# Altium project LimeMM-X8-FMC_1v0.PrjPcb (part 1 of 7)
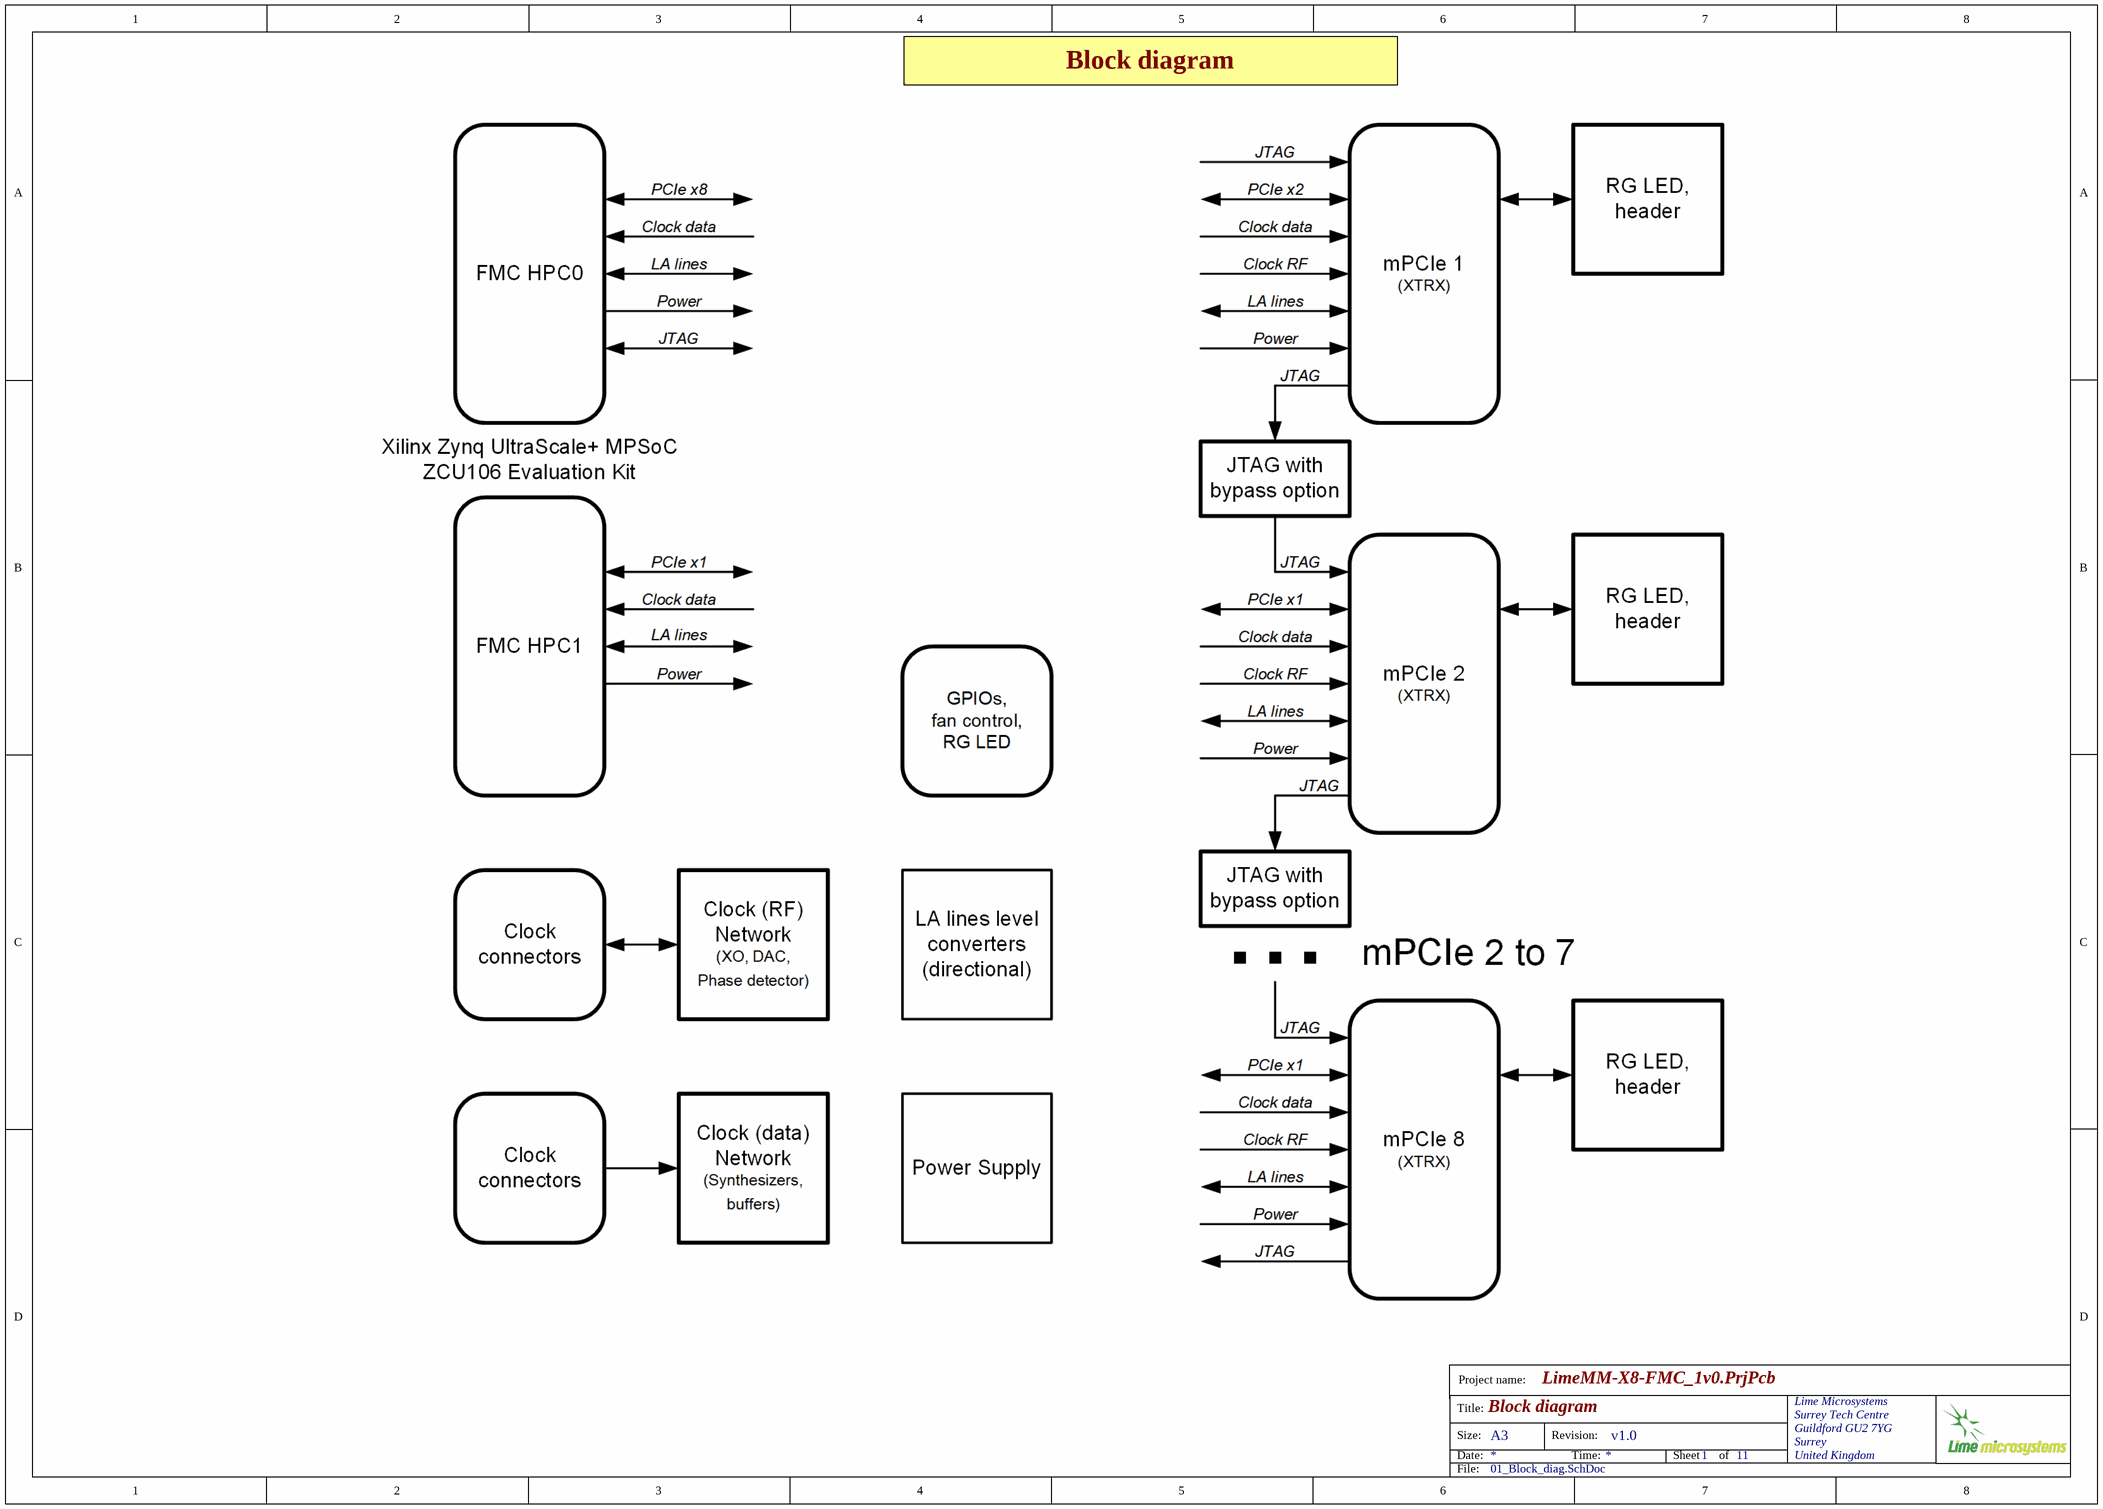
[diagram p0: 01_Block_diag.SchDoc]
11 sheets, 575 parts. Net scope: global (net labels, ports and power ports of the same name join across sheets).
Board file: LimeMM-X8-FMC_1v0.PcbDoc
Sheets:
  01_Block_diag.SchDoc
  02_Power_diag.SchDoc
  03_Clock_diag.SchDoc
  04_FMC_HPC0.SchDoc
  05_FMC_HPC1.SchDoc
  06_mPCIe_1-4.SchDoc
  07_mPCIe_5-8.SchDoc
  08_Level_conv_misc.SchDoc
  09_Clock_RF_ref.SchDoc
  10_Clock_data_ref.SchDoc
  11_Power.SchDoc

## Sheet 01_Block_diag.SchDoc: Block diagram
size A3; Organization: Lime Microsystems; Address1: Surrey Tech Centre; Address2: Guildford GU2 7YG; Address3: Surrey; Address4: United Kingdom; Revision: v1.0; SheetNumber: 1; SheetTotal: 11

### Notes on the sheet
- Block diagram
- Project name:
- Title:
- Size:
- Date:
- A3
- Revision:
- Time:
- Sheet
- of
- File:

## Sheet 02_Power_diag.SchDoc: Power diagram
size A3; Organization: Lime Microsystems; Address1: Surrey Tech Centre; Address2: Guildford GU2 7YG; Address3: Surrey; Address4: United Kingdom; Revision: v1.0; SheetNumber: 2; SheetTotal: 11
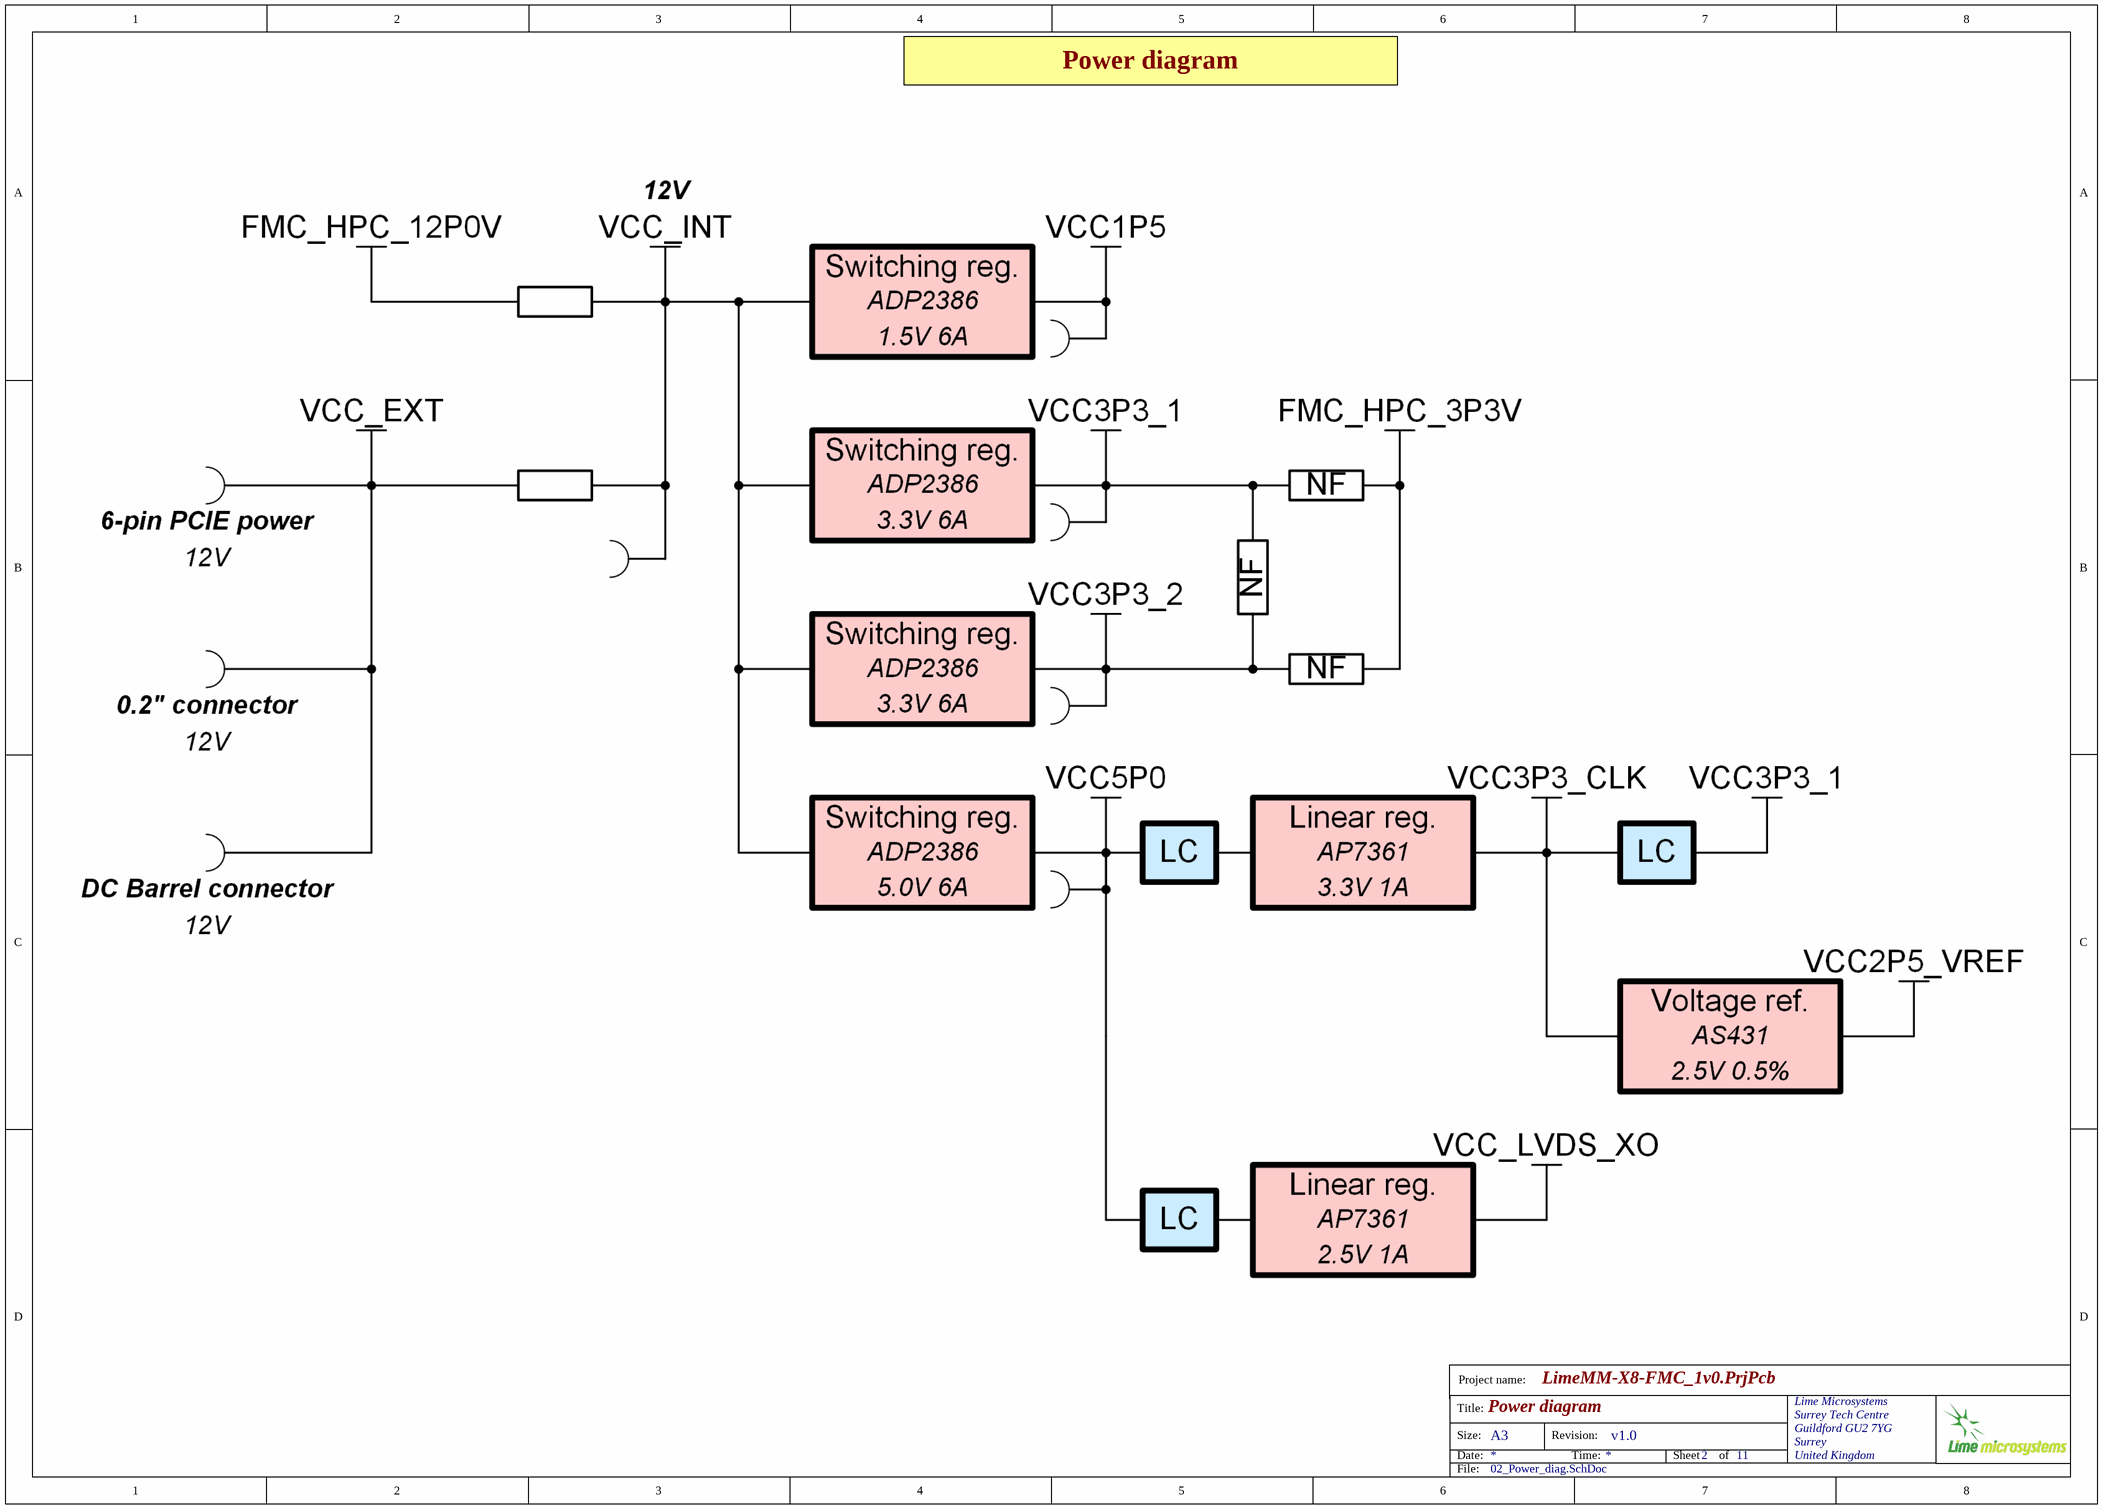
[diagram p1: 02_Power_diag.SchDoc]

### Notes on the sheet
- Power diagram
- Project name:
- Title:
- Size:
- Date:
- A3
- Revision:
- Time:
- Sheet
- of
- File:

## Sheet 03_Clock_diag.SchDoc: Clock diagram
size A3; Organization: Lime Microsystems; Address1: Surrey Tech Centre; Address2: Guildford GU2 7YG; Address3: Surrey; Address4: United Kingdom; Revision: v1.0; SheetNumber: 3; SheetTotal: 11
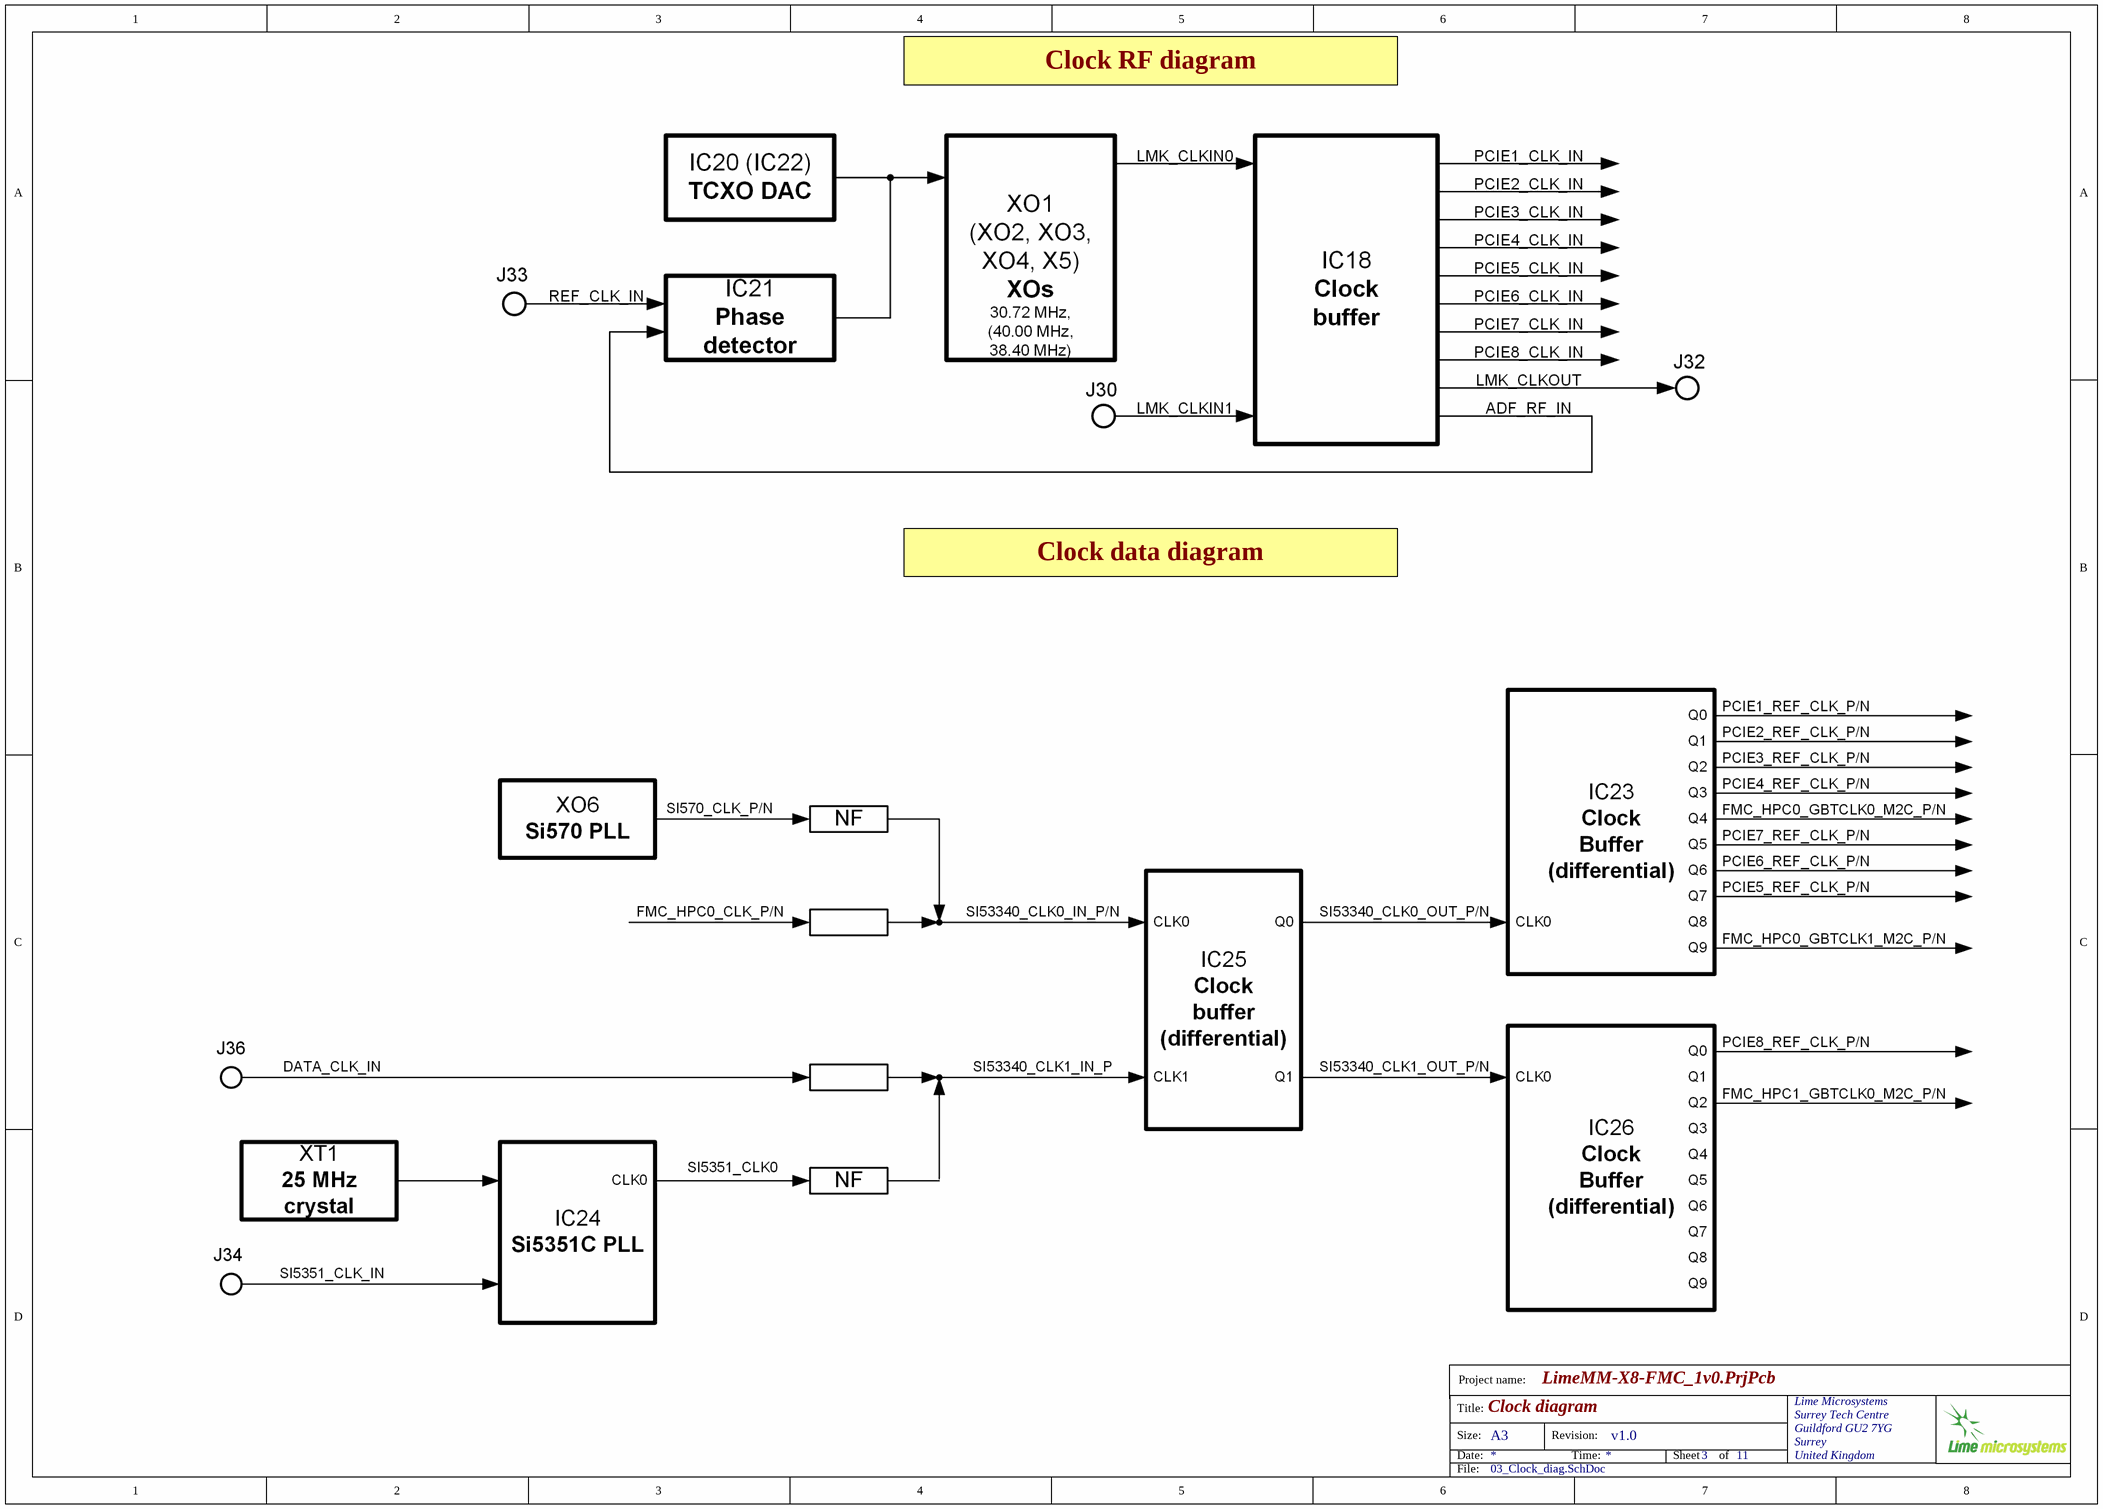
[diagram p2: 03_Clock_diag.SchDoc]

### Notes on the sheet
- Clock RF diagram
- Clock data diagram
- Project name:
- Title:
- Size:
- Date:
- A3
- Revision:
- Time:
- Sheet
- of
- File:

## Sheet 04_FMC_HPC0.SchDoc: FMC_HPC0
size A3; Organization: Lime Microsystems; Address1: Surrey Tech Centre; Address2: Guildford GU2 7YG; Address3: Surrey; Address4: United Kingdom; Revision: v1.0; SheetNumber: 4; SheetTotal: 11
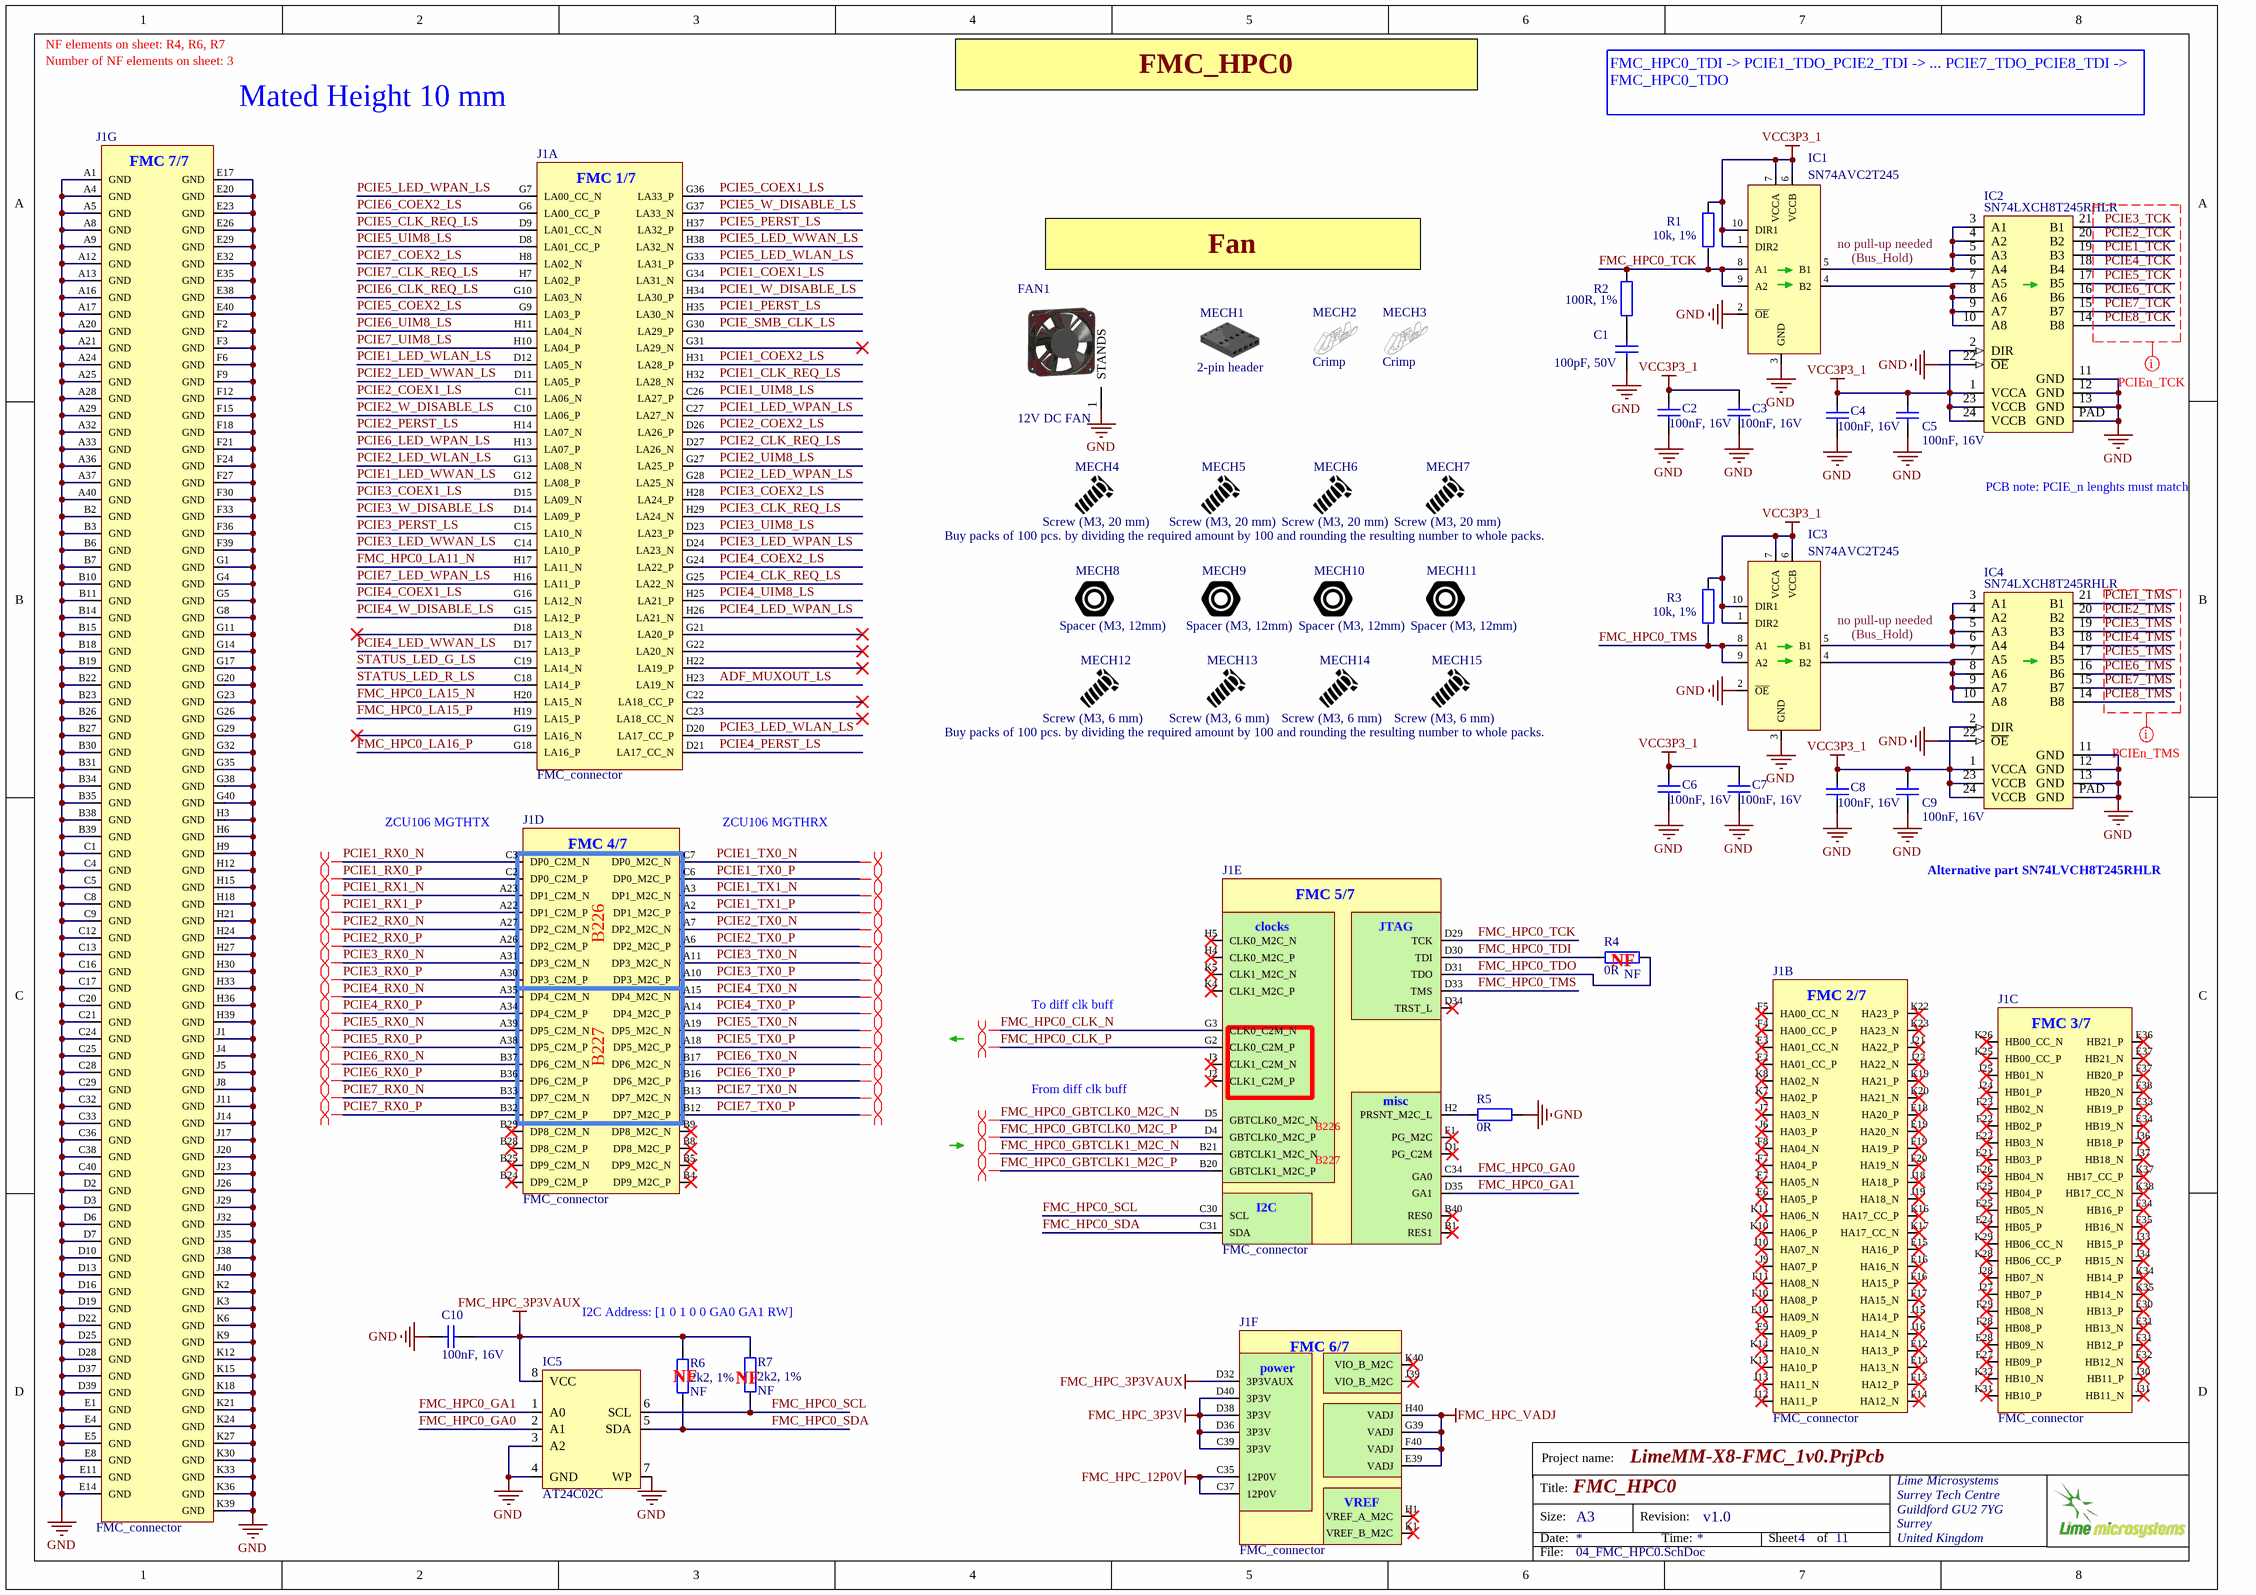
[diagram p3: 04_FMC_HPC0.SchDoc]

### Parts
C1  100pF, 50V  [CAP0402]
C2  100nF, 16V  [CAP0402]
C3  100nF, 16V  [CAP0402]
C4  100nF, 16V  [CAP0402]
C5  100nF, 16V  [CAP0402]
C6  100nF, 16V  [CAP0402]
C7  100nF, 16V  [CAP0402]
C8  100nF, 16V  [CAP0402]
C9  100nF, 16V  [CAP0402]
C10  100nF, 16V  [CAP0402]
FAN1  12V DC FAN  [FAN_80mm]
IC1  SN74AVC2T245  [SN74AVC2T245RSWR]
IC2  SN74LXCH8T245RHLR  [SN74LVC8T245RHLR_24-VQFN_LVL_SHIFTER]
IC3  SN74AVC2T245  [SN74AVC2T245RSWR]
IC4  SN74LXCH8T245RHLR  [SN74LVC8T245RHLR_24-VQFN_LVL_SHIFTER]
IC5  AT24C02C  [SOIC127P600-8DL_v2]
J1  FMC_connector  [FMC_HPC_terminal_conn_ASP-134488-01]  (parts A,B,C,D,E,F,G of 7)
MECH1  2-pin header  (mechanical)
MECH2  Crimp  (mechanical)
MECH3  Crimp  (mechanical)
MECH4  Screw (M3, 20 mm)  (mechanical)
MECH5  Screw (M3, 20 mm)  Assembly Info: Buy packs of 100 pcs. by dividing the required amount by 100 and rounding the resulting number to whole packs.  (mechanical)
MECH6  Screw (M3, 20 mm)  (mechanical)
MECH7  Screw (M3, 20 mm)  (mechanical)
MECH8  Spacer (M3, 12mm)  (mechanical)
MECH9  Spacer (M3, 12mm)  (mechanical)
MECH10  Spacer (M3, 12mm)  (mechanical)
MECH11  Spacer (M3, 12mm)  (mechanical)
MECH12  Screw (M3, 6 mm)  (mechanical)
MECH13  Screw (M3, 6 mm)  Assembly Info: Buy packs of 100 pcs. by dividing the required amount by 100 and rounding the resulting number to whole packs.  (mechanical)
MECH14  Screw (M3, 6 mm)  (mechanical)
MECH15  Screw (M3, 6 mm)  (mechanical)
R1  10k, 1%  [RES0402]
R2  100R, 1%  [RES0402]
R3  10k, 1%  [RES0402]
R4  0R  Assembly Info: NF  [RES0402]
R5  0R  [RES0402]
R6  2k2, 1%  Assembly Info: NF  [RES0402]
R7  2k2, 1%  Assembly Info: NF  [RES0402]

### Blocks framed on the sheet
B227: J1

### Nets
FMC_HPC_3P3V: J1.C39(3P3V) J1.D36(3P3V) J1.D38(3P3V) J1.D40(3P3V)
FMC_HPC_3P3VAUX: C10.1 IC5.8(VCC) J1.D32(3P3VAUX) R6.1 R7.1
FMC_HPC_12P0V: J1.C35(12P0V) J1.C37(12P0V)
FMC_HPC_VADJ: J1.E39(VADJ) J1.F40(VADJ) J1.G39(VADJ) J1.H40(VADJ)
GND: C1.2 C2.1 C3.1 C4.1 C5.1 C6.1 C7.1 C8.1 C9.1 C10.2 FAN1.1(STANDS) IC1.2(~{OE}) IC1.3(GND) IC2.11(GND) IC2.12(GND) IC2.13(GND) IC2.22(~{OE}) IC2.PAD(GND) IC3.2(~{OE}) IC3.3(GND) IC4.11(GND) IC4.12(GND) IC4.13(GND) IC4.22(~{OE}) IC4.PAD(GND) IC5.3(A2) IC5.4(GND) IC5.7(WP) J1.A1(GND) J1.A4(GND) J1.A5(GND) J1.A8(GND) J1.A9(GND) J1.A12(GND) J1.A13(GND) J1.A16(GND) J1.A17(GND) J1.A20(GND) J1.A21(GND) J1.A24(GND) J1.A25(GND) J1.A28(GND) J1.A29(GND) J1.A32(GND) J1.A33(GND) J1.A36(GND) J1.A37(GND) J1.A40(GND) J1.B2(GND) J1.B3(GND) J1.B6(GND) J1.B7(GND) J1.B10(GND) J1.B11(GND) J1.B14(GND) J1.B15(GND) J1.B18(GND) J1.B19(GND) J1.B22(GND) J1.B23(GND) J1.B26(GND) J1.B27(GND) J1.B30(GND) J1.B31(GND) J1.B34(GND) J1.B35(GND) J1.B38(GND) J1.B39(GND) J1.C1(GND) J1.C4(GND) J1.C5(GND) J1.C8(GND) J1.C9(GND) J1.C12(GND) J1.C13(GND) J1.C16(GND) J1.C17(GND) J1.C20(GND) J1.C21(GND) J1.C24(GND) J1.C25(GND) J1.C28(GND) J1.C29(GND) J1.C32(GND) J1.C33(GND) J1.C36(GND) J1.C38(GND) J1.C40(GND) J1.D2(GND) J1.D3(GND) J1.D6(GND) J1.D7(GND) J1.D10(GND) J1.D13(GND) J1.D16(GND) J1.D19(GND) J1.D22(GND) J1.D25(GND) J1.D28(GND) J1.D37(GND) J1.D39(GND) J1.E1(GND) J1.E4(GND) J1.E5(GND) J1.E8(GND) J1.E11(GND) J1.E14(GND) J1.E17(GND) J1.E20(GND) J1.E23(GND) J1.E26(GND) J1.E29(GND) J1.E32(GND) J1.E35(GND) J1.E38(GND) J1.E40(GND) J1.F2(GND) J1.F3(GND) J1.F6(GND) J1.F9(GND) J1.F12(GND) J1.F15(GND) J1.F18(GND) J1.F21(GND) J1.F24(GND) J1.F27(GND) J1.F30(GND) J1.F33(GND) J1.F36(GND) J1.F39(GND) J1.G1(GND) J1.G4(GND) J1.G5(GND) J1.G8(GND) J1.G11(GND) J1.G14(GND) J1.G17(GND) J1.G20(GND) J1.G23(GND) J1.G26(GND) J1.G29(GND) J1.G32(GND) J1.G35(GND) J1.G38(GND) J1.G40(GND) J1.H3(GND) J1.H6(GND) J1.H9(GND) J1.H12(GND) J1.H15(GND) J1.H18(GND) J1.H21(GND) J1.H24(GND) J1.H27(GND) J1.H30(GND) J1.H33(GND) J1.H36(GND) J1.H39(GND) J1.J1(GND) J1.J4(GND) J1.J5(GND) J1.J8(GND) J1.J11(GND) J1.J14(GND) J1.J17(GND) J1.J20(GND) J1.J23(GND) J1.J26(GND) J1.J29(GND) J1.J32(GND) J1.J35(GND) J1.J38(GND) J1.J40(GND) J1.K2(GND) J1.K3(GND) J1.K6(GND) J1.K9(GND) J1.K12(GND) J1.K15(GND) J1.K18(GND) J1.K21(GND) J1.K24(GND) J1.K27(GND) J1.K30(GND) J1.K33(GND) J1.K36(GND) J1.K39(GND) R5.2
VCC3P3_1: C2.2 C3.2 C4.2 C5.2 C6.2 C7.2 C8.2 C9.2 IC1.1(DIR2) IC1.6(VCCB) IC1.7(VCCA) IC1.10(DIR1) IC2.1(VCCA) IC2.2(DIR) IC2.23(VCCB) IC2.24(VCCB) IC3.1(DIR2) IC3.6(VCCB) IC3.7(VCCA) IC3.10(DIR1) IC4.1(VCCA) IC4.2(DIR) IC4.23(VCCB) IC4.24(VCCB) R1.1 R3.1
ADF_MUXOUT_LS: J1.H23(LA19_N)
FMC_HPC0_CLK_N: J1.G3(CLK0_C2M_N)
FMC_HPC0_CLK_P: J1.G2(CLK0_C2M_P)
FMC_HPC0_GA0: IC5.2(A1) J1.C34(GA0)
FMC_HPC0_GA1: IC5.1(A0) J1.D35(GA1)
FMC_HPC0_GBTCLK0_M2C_N: J1.D5(GBTCLK0_M2C_N)
FMC_HPC0_GBTCLK0_M2C_P: J1.D4(GBTCLK0_M2C_P)
FMC_HPC0_GBTCLK1_M2C_N: J1.B21(GBTCLK1_M2C_N)
FMC_HPC0_GBTCLK1_M2C_P: J1.B20(GBTCLK1_M2C_P)
FMC_HPC0_LA11_N: J1.H17(LA11_N)
FMC_HPC0_LA15_N: J1.H20(LA15_N)
FMC_HPC0_LA15_P: J1.H19(LA15_P)
FMC_HPC0_LA16_P: J1.G18(LA16_P)
FMC_HPC0_SCL: IC5.6(SCL) J1.C30(SCL) R7.2
FMC_HPC0_SDA: IC5.5(SDA) J1.C31(SDA) R6.2
FMC_HPC0_TCK: IC1.8(A1) IC1.9(A2) J1.D29(TCK) R1.2 R2.2
FMC_HPC0_TDI: J1.D30(TDI) R4.2
FMC_HPC0_TDO: J1.D31(TDO) R4.1
FMC_HPC0_TMS: IC3.8(A1) IC3.9(A2) J1.D33(TMS) R3.2
PCIE1_CLK_REQ_LS: J1.H32(LA28_N)
PCIE1_COEX1_LS: J1.G34(LA31_N)
PCIE1_COEX2_LS: J1.H31(LA28_P)
PCIE1_LED_WLAN_LS: J1.D12(LA05_N)
PCIE1_LED_WPAN_LS: J1.C27(LA27_N)
PCIE1_LED_WWAN_LS: J1.G12(LA08_P)
PCIE1_PERST_LS: J1.H35(LA30_N)
PCIE1_RX0_N: J1.C3(DP0_C2M_N)
PCIE1_RX0_P: J1.C2(DP0_C2M_P)
PCIE1_RX1_N: J1.A23(DP1_C2M_N)
PCIE1_RX1_P: J1.A22(DP1_C2M_P)
PCIE1_TCK: IC2.19(B3)
PCIE1_TMS: IC4.21(B1)
PCIE1_TX0_N: J1.C7(DP0_M2C_N)
PCIE1_TX0_P: J1.C6(DP0_M2C_P)
PCIE1_TX1_N: J1.A3(DP1_M2C_N)
PCIE1_TX1_P: J1.A2(DP1_M2C_P)
PCIE1_UIM8_LS: J1.C26(LA27_P)
PCIE1_W_DISABLE_LS: J1.H34(LA30_P)
PCIE2_CLK_REQ_LS: J1.D27(LA26_N)
PCIE2_COEX1_LS: J1.C11(LA06_N)
PCIE2_COEX2_LS: J1.D26(LA26_P)
PCIE2_LED_WLAN_LS: J1.G13(LA08_N)
PCIE2_LED_WPAN_LS: J1.G28(LA25_N)
PCIE2_LED_WWAN_LS: J1.D11(LA05_P)
PCIE2_PERST_LS: J1.H14(LA07_N)
PCIE2_RX0_N: J1.A27(DP2_C2M_N)
PCIE2_RX0_P: J1.A26(DP2_C2M_P)
PCIE2_TCK: IC2.20(B2)
PCIE2_TMS: IC4.20(B2)
PCIE2_TX0_N: J1.A7(DP2_M2C_N)
PCIE2_TX0_P: J1.A6(DP2_M2C_P)
PCIE2_UIM8_LS: J1.G27(LA25_P)
PCIE2_W_DISABLE_LS: J1.C10(LA06_P)
PCIE3_CLK_REQ_LS: J1.H29(LA24_N)
PCIE3_COEX1_LS: J1.D15(LA09_N)
PCIE3_COEX2_LS: J1.H28(LA24_P)
PCIE3_LED_WLAN_LS: J1.D20(LA17_CC_P)
PCIE3_LED_WPAN_LS: J1.D24(LA23_N)
PCIE3_LED_WWAN_LS: J1.C14(LA10_P)
PCIE3_PERST_LS: J1.C15(LA10_N)
PCIE3_RX0_N: J1.A31(DP3_C2M_N)
PCIE3_RX0_P: J1.A30(DP3_C2M_P)
PCIE3_TCK: IC2.21(B1)
PCIE3_TMS: IC4.19(B3)
PCIE3_TX0_N: J1.A11(DP3_M2C_N)
PCIE3_TX0_P: J1.A10(DP3_M2C_P)
PCIE3_UIM8_LS: J1.D23(LA23_P)
PCIE3_W_DISABLE_LS: J1.D14(LA09_P)
PCIE4_CLK_REQ_LS: J1.G25(LA22_N)
PCIE4_COEX1_LS: J1.G16(LA12_N)
PCIE4_COEX2_LS: J1.G24(LA22_P)
PCIE4_LED_WPAN_LS: J1.H26(LA21_N)
PCIE4_LED_WWAN_LS: J1.D17(LA13_P)
PCIE4_PERST_LS: J1.D21(LA17_CC_N)
PCIE4_RX0_N: J1.A35(DP4_C2M_N)
PCIE4_RX0_P: J1.A34(DP4_C2M_P)
PCIE4_TCK: IC2.18(B4)
PCIE4_TMS: IC4.18(B4)
PCIE4_TX0_N: J1.A15(DP4_M2C_N)
PCIE4_TX0_P: J1.A14(DP4_M2C_P)
PCIE4_UIM8_LS: J1.H25(LA21_P)
PCIE4_W_DISABLE_LS: J1.G15(LA12_P)
PCIE5_CLK_REQ_LS: J1.D9(LA01_CC_N)
PCIE5_COEX1_LS: J1.G36(LA33_P)
PCIE5_COEX2_LS: J1.G9(LA03_P)
PCIE5_LED_WLAN_LS: J1.G33(LA31_P)
PCIE5_LED_WPAN_LS: J1.G7(LA00_CC_N)
PCIE5_LED_WWAN_LS: J1.H38(LA32_N)
PCIE5_PERST_LS: J1.H37(LA32_P)
PCIE5_RX0_N: J1.A39(DP5_C2M_N)
PCIE5_RX0_P: J1.A38(DP5_C2M_P)
PCIE5_TCK: IC2.17(B5)
PCIE5_TMS: IC4.17(B5)
PCIE5_TX0_N: J1.A19(DP5_M2C_N)
PCIE5_TX0_P: J1.A18(DP5_M2C_P)
PCIE5_UIM8_LS: J1.D8(LA01_CC_P)
PCIE5_W_DISABLE_LS: J1.G37(LA33_N)
PCIE6_CLK_REQ_LS: J1.G10(LA03_N)
PCIE6_COEX2_LS: J1.G6(LA00_CC_P)
PCIE6_LED_WPAN_LS: J1.H13(LA07_P)
PCIE6_RX0_N: J1.B37(DP6_C2M_N)
PCIE6_RX0_P: J1.B36(DP6_C2M_P)
PCIE6_TCK: IC2.16(B6)
PCIE6_TMS: IC4.16(B6)
PCIE6_TX0_N: J1.B17(DP6_M2C_N)
PCIE6_TX0_P: J1.B16(DP6_M2C_P)
PCIE6_UIM8_LS: J1.H11(LA04_N)
PCIE7_CLK_REQ_LS: J1.H7(LA02_P)
PCIE7_COEX2_LS: J1.H8(LA02_N)
PCIE7_LED_WPAN_LS: J1.H16(LA11_P)
PCIE7_RX0_N: J1.B33(DP7_C2M_N)
PCIE7_RX0_P: J1.B32(DP7_C2M_P)
PCIE7_TCK: IC2.15(B7)
PCIE7_TMS: IC4.15(B7)
PCIE7_TX0_N: J1.B13(DP7_M2C_N)
PCIE7_TX0_P: J1.B12(DP7_M2C_P)
PCIE7_UIM8_LS: J1.H10(LA04_P)
PCIE8_TCK: IC2.14(B8)
PCIE8_TMS: IC4.14(B8)
PCIE_SMB_CLK_LS: J1.G30(LA29_P)
STATUS_LED_G_LS: J1.C19(LA14_N)
STATUS_LED_R_LS: J1.C18(LA14_P)
NetC1_1: C1.1 R2.1
NetIC1_4: IC1.4(B2) IC2.7(A5) IC2.8(A6) IC2.9(A7) IC2.10(A8)
NetIC1_5: IC1.5(B1) IC2.3(A1) IC2.4(A2) IC2.5(A3) IC2.6(A4)
NetIC3_4: IC3.4(B2) IC4.7(A5) IC4.8(A6) IC4.9(A7) IC4.10(A8)
NetIC3_5: IC3.5(B1) IC4.3(A1) IC4.4(A2) IC4.5(A3) IC4.6(A4)
NetJ1_H2: J1.H2(PRSNT_M2C_L) R5.1

Not connected (* = marked no-connect by the designer): J1 B1(RES1)* B4(DP9_M2C_P)* B5(DP9_M2C_N)* B8(DP8_M2C_P)* B9(DP8_M2C_N)* B24(DP9_C2M_P)* B25(DP9_C2M_N)* B28(DP8_C2M_P)* B29(DP8_C2M_N)* B40(RES0)* C22(LA18_CC_P)* C23(LA18_CC_N)* D1(PG_C2M)* D18(LA13_N)* D34(TRST_L)* E2(HA01_CC_P)* E3(HA01_CC_N)* E6(HA05_P)* E7(HA05_N)* E9(HA09_P)* E10(HA09_N)* E12(HA13_P)* E13(HA13_N)* E15(HA16_P)* E16(HA16_N)* E18(HA20_P)* E19(HA20_N)* E21(HB03_P)* E22(HB03_N)* E24(HB05_P)* E25(HB05_N)* E27(HB09_P)* E28(HB09_N)* E30(HB13_P)* E31(HB13_N)* E33(HB19_P)* E34(HB19_N)* E36(HB21_P)* E37(HB21_N)* F1(PG_M2C)* F4(HA00_CC_P)* F5(HA00_CC_N)* F7(HA04_P)* F8(HA04_N)* F10(HA08_P)* F11(HA08_N)* F13(HA12_P)* F14(HA12_N)* F16(HA15_P)* F17(HA15_N)* F19(HA19_P)* F20(HA19_N)* F22(HB02_P)* F23(HB02_N)* F25(HB04_P)* F26(HB04_N)* F28(HB08_P)* F29(HB08_N)* F31(HB12_P)* F32(HB12_N)* F34(HB16_P)* F35(HB16_N)* F37(HB20_P)* F38(HB20_N)* G19(LA16_N)* G21(LA20_P)* G22(LA20_N)* G31(LA29_N)* H1(VREF_A_M2C)* H4(CLK0_M2C_P)* H5(CLK0_M2C_N)* H22(LA19_P)* J2(CLK1_C2M_P)* J3(CLK1_C2M_N)* J6(HA03_P)* J7(HA03_N)* J9(HA07_P)* J10(HA07_N)* J12(HA11_P)* J13(HA11_N)* J15(HA14_P)* J16(HA14_N)* J18(HA18_P)* J19(HA18_N)* J21(HA22_P)* J22(HA22_N)* J24(HB01_P)* J25(HB01_N)* J27(HB07_P)* J28(HB07_N)* J30(HB11_P)* J31(HB11_N)* J33(HB15_P)* J34(HB15_N)* J36(HB18_P)* J37(HB18_N)* J39(VIO_B_M2C)* K1(VREF_B_M2C)* K4(CLK1_M2C_P)* K5(CLK1_M2C_N)* K7(HA02_P)* K8(HA02_N)* K10(HA06_P)* K11(HA06_N)* K13(HA10_P)* K14(HA10_N)* K16(HA17_CC_P)* K17(HA17_CC_N)* K19(HA21_P)* K20(HA21_N)* K22(HA23_P)* K23(HA23_N)* K25(HB00_CC_P)* K26(HB00_CC_N)* K28(HB06_CC_P)* K29(HB06_CC_N)* K31(HB10_P)* K32(HB10_N)* K34(HB14_P)* K35(HB14_N)* K37(HB17_CC_P)* K38(HB17_CC_N)* K40(VIO_B_M2C)*

### Layout directives
differential pair: FMC_HPC0_CLK_N, FMC_HPC0_CLK_P, FMC_HPC0_GBTCLK0_M2C_N, FMC_HPC0_GBTCLK0_M2C_P, FMC_HPC0_GBTCLK1_M2C_N, FMC_HPC0_GBTCLK1_M2C_P, PCIE1_RX0_N, PCIE1_RX0_P, PCIE1_RX1_N, PCIE1_RX1_P, PCIE1_TX0_N, PCIE1_TX0_P, PCIE1_TX1_N, PCIE1_TX1_P, PCIE2_RX0_N, PCIE2_RX0_P, PCIE2_TX0_N, PCIE2_TX0_P, PCIE3_RX0_N, PCIE3_RX0_P, PCIE3_TX0_N, PCIE3_TX0_P, PCIE4_RX0_N, PCIE4_RX0_P, PCIE4_TX0_N, PCIE4_TX0_P, PCIE5_RX0_N, PCIE5_RX0_P, PCIE5_TX0_N, PCIE5_TX0_P, PCIE6_RX0_N, PCIE6_RX0_P, PCIE6_TX0_N, PCIE6_TX0_P, PCIE7_RX0_N, PCIE7_RX0_P, PCIE7_TX0_N, PCIE7_TX0_P
net class PCIEn_TCK: PCIE1_TCK, PCIE2_TCK, PCIE3_TCK, PCIE4_TCK, PCIE5_TCK, PCIE6_TCK, PCIE7_TCK, PCIE8_TCK
net class PCIEn_TMS: (no net found under the mark)

### Notes on the sheet
- NF elements on sheet: R4, R6, R7
- Number of NF elements on sheet: 3
- Mated Height 10 mm
- FMC_HPC0
- FMC_HPC0_TDI -> PCIE1_TDO_PCIE2_TDI -> ... PCIE7_TDO_PCIE8_TDI -> FMC_HPC0_TDO
- Fan
- (near IC1) no pull-up needed
- (near IC1) (Bus_Hold)
- PCB note: PCIE_n lenghts must match
- (near IC3) no pull-up needed
- (near IC3) (Bus_Hold)
- ZCU106 MGTHTX
- (near J1) ZCU106 MGTHRX
- Alternative part SN74LVCH8T245RHLR
- (near J1) B226
- (near R4) NF
- To diff clk buff
- From diff clk buff
- (near J1) B227
- I2C Address: [1 0 1 0 0 GA0 GA1 RW]
- (near R6) NF
- (near R7) NF
- Project name:
- Title:
- Size:
- Date:
- A3
- Revision:
- Time:
- Sheet
- of
- File:
- (in symbol FMC_connector, part A) FMC 1/7
- (in symbol FMC_connector, part B) FMC 2/7
- (in symbol FMC_connector, part C) FMC 3/7
- (in symbol FMC_connector, part D) FMC 4/7
- (in symbol FMC_connector, part E) FMC 5/7; clocks /; JTAG /; misc /; I2C /
- (in symbol FMC_connector, part F) FMC 6/7; power /; VREF /
- (in symbol FMC_connector, part G) FMC 7/7

### Library data of the parts
C1 = Cap_0402: Manufacturer Part Number 1: CC0402JRNPO9BN101; Manufacturer: Yageo; Part Description: 100pF ±5% 50V C0G, NP0 Ceramic Capacitor -55°C ~ 125°C Surface Mount, MLCC 0402 (1005 Metric) 0.039" L x 0.020" W (1.00mm x 0.50mm); Tolerance: ±5%; Temperature Coefficient: C0G, NP0; Value: 100pF, 50V; Capacitance: 100pF; Thickness (Max): 0.022" (0.55mm); Size / Dimension: 0.039" L x 0.020" W (1.00mm x 0.50mm); RoHS: RoHS Compliant; Ratings: -; Package / Case: 0402 (1005 Metric); Mounting Type: Surface Mount, MLCC; Height - Seated (Max): -; Features: -; Lead Spacing: -; Voltage - Rated: 50V; Operating Temperature: -55°C ~ 125°C; Packaging: Cut Tape (CT); Applications: General Purpose; Lead Style: -; Supplier 1: Digi-Key; Category: Capacitors; Supplier Part Number 1: 311-1024-1-ND
C2-C10 = Cap_0603: Manufacturer Part Number 1: GRM155R71C104KA88D; Part Description: 0.10µF ±10% 16V X7R Ceramic Capacitor -55°C ~ 125°C Surface Mount, MLCC 0402 (1005 Metric) 0.039" L x 0.020" W (1.00mm x 0.50mm); Brand: Murata Electronics; Tolerance: 10 %; Type: General Purpose MLCC; Capacitance: 0.1 uF; Temperature Coefficient / Code: +/- 15 %; Case Height: 0.5 mm; Case Length: 1 mm; Dielectric: X7R; Supplier 1: Mouser; Supplier Part Number 1: 81-GRM155R71C104KA88; Case Code - in: 0402; Manufacturer: Murata Electronics; Category: Multilayer Ceramic Capacitors MLCC - SMD/SMT; Voltage Rating DC: 16 V; Value: 100nF, 16V; Case Code - mm: 1005; Case Width: 0.5 mm; Maximum Operating Temperature: + 125 C; Minimum Operating Temperature: - 55 C; Minimum Order Quantity: 1; Operating Temperature Range: - 55 C to + 125 C; Package / Case: 0402 (1005 metric); Packaging: Reel; Product: General Type MLCCs; Product Category: Low & Medium Capacitance SMD Ceramic Chip Capacitors; Reeling: True; RoHS - Mouser: Y; RoHS: RoHS Compliant; Series: GRM; Standard Pack Qty: 10000; Termination Style: SMD/SMT
FAN1 = 12V_DC_FAN: Part Description: Fan Tubeaxial 12VDC Square - 80mm L x 80mm H Vapo-Bearing™ 37.0 CFM (1.04m³/min) 2 Wire Leads; Manufacturer: Sunon; Manufacturer Part Number 1: ME80151V1-000U-A99; Airflow: 37CFM; Noise: 34.7dBA; Max Power Dissipation: 1.96W; RPM: 3000RPM; Bearing Type: Vapo-Bearing; Current Rating: 163mA; Approvals: UL,CE,TUV; Supplier 1: Digi-Key; Supplier Part Number 1: 259-1649-ND; Stock 1: 1611; Pricing 1: 1=6,90000, 10=6,66700, 25=6,47400, 50=6,08860, 100=5,47200, 250=5,39488, 500=5,04808 (USD); RoHS: Yes; Case/Package: Axial; Housing Material: Thermoplastic; Weight: 0.15lb; Min Operating Temperature: 14°C; Max Operating Temperature: 158°C; Termination: 2 Wire Leads; Package Quantity: 30; Width: 15mm; Flammability Rating: UL94 V-0; ComponentLink1URL: https://datasheet.ciiva.com/18514/me8015-u-18514537.pdf?src-supplier=Digi-Key; ComponentLink1Description: https://datasheet.ciiva.com/18514/me8015-u-18514537.pdf?src-supplier=Digi-Key
IC1 IC3 = SN74AVC2T245: Part Description: Translation Transceiver 1 Element 2 Bit per Element 3-State Output 10-UQFN (1.8x1.4); Manufacturer: Texas Instruments; Input Type: Logic; Logic Function: Translator, Bidirectional, 3-State; Data Rate: 500Mbps; Propagation Delay (Max): 2.4ns; Voltage - Supply: 1.2 V ~ 3.6 V; Supplier 1: Digi-Key; Category: Integrated Circuits (ICs); Supplier Device Package: 10-UQFN (1.8x1.4); Package / Case: 10-UFQFN; Supplier Part Number 1: 296-23684-1-ND; Manufacturer Part Number 1: SN74AVC2T245RSWR
IC2 IC4 = SN74LVC8T245RHLR_LVL_SHIFTER: Part Description: Translation Transceiver 1 Element 8 Bit per Element 3-State Output 24-VQFN (5.5x3.5); Manufacturer: Texas Instruments; ComponentLink1Description: https://datasheet.ciiva.com/15086/getdatasheetpartid-241541-15086413.pdf?src-supplier=Verical; ComponentLink1URL: https://datasheet.ciiva.com/15086/getdatasheetpartid-241541-15086413.pdf?src-supplier=Verical; ComponentLink2Description: https://datasheet.ciiva.com/1836/sn74lvch8t245-1836035.pdf?src-supplier=Digi-Key; ComponentLink2URL: https://datasheet.ciiva.com/1836/sn74lvch8t245-1836035.pdf?src-supplier=Digi-Key; ComponentLink3Description: https://datasheet.ciiva.com/1836/sn74lvch8t245-1836034.pdf?src-supplier=Digi-Key; ComponentLink3URL: https://datasheet.ciiva.com/1836/sn74lvch8t245-1836034.pdf?src-supplier=Digi-Key; ComponentLink4Description: https://datasheet.ciiva.com/1836/sn74lvch8t245-1836036.pdf?src-supplier=Digi-Key; ComponentLink4URL: https://datasheet.ciiva.com/1836/sn74lvch8t245-1836036.pdf?src-supplier=Digi-Key; ComponentLink5Description: https://datasheet.ciiva.com/14300/sn74lvch8t245-14300662.pdf?src-supplier=Avnet; ComponentLink5URL: https://datasheet.ciiva.com/14300/sn74lvch8t245-14300662.pdf?src-supplier=Avnet; Manufacturer Part Number 1: SN74LXCH8T245RHLR; Pricing 1: 1=2,1, 10=1,883, 25=1,7768, 100=1,5138, 250=1,4214, 500=1,24372, 1000=1,03052 (USD); RoHS: No; Stock 1: 2724; Supplier 1: Digi-Key; Supplier Part Number 1: 296-SN74LXCH8T245RHLRCT-ND
IC5 = AT24C02C-SSHM-B: Manufacturer: ATMEL; Manufacturer Part Number 1: AT24C02C-SSHM-T; Part Description: EEPROM Memory IC 2Kbit I²C 1 MHz 550 ns 8-SOIC; Supplier 1: Farnell; Supplier Part Number 1: 2345577
J1 = FMC_connector: Part Description: 400 Position Connector Array, Male Pins Surface Mount Gold; Manufacturer: Samtec; Manufacturer Part Number 1: ASP-134488-01; Gender: Male; Number of Contacts: 400; Pitch: 1.27mm; ComponentLink1Description: https://datasheet.ciiva.com/403/asp-134488-01-403749.pdf?src-supplier=Digi-Key; ComponentLink1URL: https://datasheet.ciiva.com/403/asp-134488-01-403749.pdf?src-supplier=Digi-Key; ComponentLink2Description: https://datasheet.ciiva.com/9532/asp-134488-01-9532666.pdf?src-supplier=Avnet; ComponentLink2URL: https://datasheet.ciiva.com/9532/asp-134488-01-9532666.pdf?src-supplier=Avnet; Contact Material: Copper Alloy; Contact Plating: Gold; Mount: Surface Mount; Number of Positions: 400; Number of Rows: 10; Packaging: Strip; Pricing 1: 1=31,75, 10=27,799, 25=26,598, 50=25,7398, 100=24,8819, 250=23,50908 (USD); Radiation Hardening: No; Reach SVHC Compliant: No; RoHS: Yes; RoHS Compliant: Yes; Series: ASP; Stock 1: 1651; Supplier 1: Digi-Key; Supplier Part Number 1: SAM8730-ND; Termination: SMD/SMT
MECH1 = Universal_crimped_header: Part Description: 2 Rectangular Connectors - Housings Receptacle White 0.100" (2.54mm); Manufacturer: Molex; Gender: Female; Voltage Rating: 250V; Number of Contacts: 2; Connector Type: Receptacle; Max Current Rating: 4A; Pitch: 2.54mm; Glow Wire Compliant: Non-compliant; Approvals: UL,CSA; Supplier 1: Newark; Supplier Part Number 1: 47T5763; Manufacturer Part Number 1: 22-01-2027; Stock 1: 50789; Pricing 1: 1=0,12200, 10=0,09500, 25=0,08600, 50=0,07700, 100=0,06700, 250=0,06400 (USD); RoHS: Yes; Mount: Free Hanging,Cable; Contact Material: Bronze,Brass; Color: White; Housing Color: White; Housing Material: Nylon; Min Operating Temperature: 0°C; Max Operating Temperature: 75°C; Number of Rows: 1; Package Quantity: 5000; Packaging: Bag; Termination: Crimp; Number of Circuits: 2; Number of Positions: 2; Orientation: Straight; Series: KK® 2695; Contact Type: Non-Gendered; Contact Gender: Female; Fastening Type: Ramp; Length: 5.64mm; Width: 4.82mm; Height: 4.82mm; Depth: 12.7mm; Lead Pitch: 2.54mm; Radiation Hardening: No; Halogen Free: Low Halogen; Flammability Rating: UL94 V-0; RoHS Compliant: Yes; Lead Free: Lead Free
MECH2 MECH3 = Universal_crimp: Part Description: Non-Gendered Contact Tin 22-30 AWG Crimp; Manufacturer: Molex; Body Plating: Tin; Current Rating: 4A; Voltage Rating: 250V; Gender: Female; Connector Type: PCB; Number of Contacts: 1; Contact Resistance: 20mR; Max Current Rating: 2.5A; Resistance: 0.02R; Insulation Resistance: 500GR; Shielding: Unshielded; Wire Gauge (Max): 22AWG; Wire Gauge (Min): 30AWG; Wire/Cable Diameter: 1.57mm; Approvals: UL,CSA; Supplier 1: Mouser; Supplier Part Number 1: 538-08-50-0032; Manufacturer Part Number 1: 08-50-0032; Stock 1: 153072; Pricing 1: 1=0,12000, 10=0,08100, 50=0,08000, 100=0,08000, 1000=0,06400, 10000=0,06400 (USD); RoHS: Yes; Mount: Cable; Contact Material: Brass; Housing Material: Nylon; Terminal Material: Brass; Contact Plating: Tin,Brass; Min Operating Temperature: 0°C; Max Operating Temperature: 75°C; Contact Gender: Female; Packaging: Bulk; Termination: Crimp; Orientation: Straight; Series: KK® 4809; Contact Type: Signal; Voltage Rating (AC): 250V; Package Quantity: 80000; Max Voltage Rating (AC): 250V; Length: 10.4mm; Depth: 2.1mm; Wire/Cable Gauge: 30AWG; Radiation Hardening: No; RoHS Compliant: Yes; Reach SVHC Compliant: Yes; ComponentLink1URL: https://datasheet.ciiva.com/15217/getdatasheetpartid-168593-15217171.pdf?src-supplier=Verical; ComponentLink1Description: https://datasheet.ciiva.com/15217/getdatasheetpartid-168593-15217171.pdf?src-supplier=Verical; ComponentLink2URL: https://datasheet.ciiva.com/19462/736464-19462410.pdf?src-supplier=Jameco; ComponentLink2Description: https://datasheet.ciiva.com/19462/736464-19462410.pdf?src-supplier=Jameco; ComponentLink3URL: https://datasheet.ciiva.com/11723/0900766b80027326-11723308.pdf?src-supplier=Rs; ComponentLink3Description: https://datasheet.ciiva.com/11723/0900766b80027326-11723308.pdf?src-supplier=Rs
MECH4 MECH6 MECH7 = Universal_mech_screw: Part Description: Machine Screw, M3, 20 mm, Steel, Bright Zinc, Flat / Countersunk Head Pozidriv, Pack of 100; Manufacturer: TR Fastenings; Manufacturer Part Number 1: M3 20 KRSTMC Z100; Assembly Info: Buy packs of 100 pcs. by dividing the required amount by 100 and rounding the resulting number to whole packs.; Supplier 1: Farnell; Supplier Part Number 1: 1420401; Stock 1: 226; Pricing 1: 1=2,66000, 30=1,88000, 60=1,77000 (EUR); RoHS: No; ComponentLink1URL: http://www.farnell.com/datasheets/2644719.pdf?src-supplier=Farnell; ComponentLink1Description: http://www.farnell.com/datasheets/2644719.pdf?src-supplier=Farnell
MECH5 = Universal_mech_screw: Part Description: Machine Screw, M3, 20 mm, Steel, Bright Zinc, Flat / Countersunk Head Pozidriv, Pack of 100; Manufacturer: TR Fastenings; Manufacturer Part Number 1: M3 20 KRSTMC Z100; Supplier 1: Farnell; Supplier Part Number 1: 1420401; Stock 1: 226; Pricing 1: 1=2,66000, 30=1,88000, 60=1,77000 (EUR); RoHS: No; ComponentLink1URL: http://www.farnell.com/datasheets/2644719.pdf?src-supplier=Farnell; ComponentLink1Description: http://www.farnell.com/datasheets/2644719.pdf?src-supplier=Farnell
MECH8-MECH11 = Universal_mech_nut: Part Description: Standoff, Brass, M3, Hex Female, 12 mm, 12 mm; Manufacturer: ETTINGER; Manufacturer Part Number 1: 005.03.123; Supplier 1: Farnell; Supplier Part Number 1: 1466772
MECH12 MECH14 MECH15 = Universal_mech_screw: Part Description: Machine Screw, M3, 6 mm, Steel 4.8, Bright Zinc, Pan Head Pozidriv; Manufacturer: TR Fastenings; Manufacturer Part Number 1: M3 6 PRSTMC Z100; Assembly Info: Buy packs of 100 pcs. by dividing the required amount by 100 and rounding the resulting number to whole packs.; Supplier 1: Farnell; Supplier Part Number 1: 1419986; Stock 1: 2173; Pricing 1: 1=1,90000, 25=1,35000, 50=1,23000 (EUR); RoHS: No; ComponentLink1URL: http://www.farnell.com/datasheets/2644718.pdf?src-supplier=Farnell; ComponentLink1Description: http://www.farnell.com/datasheets/2644718.pdf?src-supplier=Farnell
MECH13 = Universal_mech_screw: Part Description: Machine Screw, M3, 6 mm, Steel 4.8, Bright Zinc, Pan Head Pozidriv; Manufacturer: TR Fastenings; Manufacturer Part Number 1: M3 6 PRSTMC Z100; Supplier 1: Farnell; Supplier Part Number 1: 1419986; Stock 1: 2173; Pricing 1: 1=1,90000, 25=1,35000, 50=1,23000 (EUR); RoHS: No; ComponentLink1URL: http://www.farnell.com/datasheets/2644718.pdf?src-supplier=Farnell; ComponentLink1Description: http://www.farnell.com/datasheets/2644718.pdf?src-supplier=Farnell
R1 R3 = Res_0402: Manufacturer: Yageo; Manufacturer Part Number 1: RC0402FR-0710KL; Part Description: RES SMD 10K OHM 1% 1/16W 0402; Temperature Coefficient: ±100ppm/°C; Power (Watts): 0.063W, 1/16W; Value: 10k, 1%; Supplier 1: Digi-Key; Supplier Part Number 1: 311-10.0KLRTR-ND; Resistance (Ohms): 10k; Packaging: Tape & Reel (TR); RoHS: RoHS Compliant; Package / Case: 0402 (1005 Metric); Tolerance: ±1%; Operating Temperature: -55°C ~ 155°C; Size / Dimension: 0.039" L x 0.020" W (1.00mm x 0.50mm); Number of Terminations: 2; Category: Resistors; Height: 0.016" (0.40mm); Supplier Device Package: 0402; Features: Moisture Resistant; Composition: Thick Film
R2 = Res_0402: Manufacturer Part Number 1: RMCF0402FT100R; Part Description: RES SMD 100 OHM 1% 1/16W 0402; Manufacturer: Stackpole Electronics Inc.; Temperature Coefficient: ±100ppm/°C; Supplier 1: Digi-Key; Supplier Part Number 1: RMCF0402FT100RDKR-ND; Package / Case: 0402 (1005 Metric); Composition: Thick Film; Category: Resistors; Tolerance: ±1%; Value: 100R, 1%
R4 R5 = Res_0402: Manufacturer Part Number 1: RC0402JR-070RL; Manufacturer: Yageo; Part Description: RES SMD 0.0OHM JUMPER 1/16W 0402; Resistance (Ohms): 0.0; Tolerance: Jumper; Power (Watts): 0.063W, 1/16W; Value: 0R; Supplier 1: Digi-Key; Supplier Part Number 1: 311-0.0JRTR-ND; Category: Resistors; Temperature Coefficient: -; Features: Moisture Resistant; Supplier Device Package: 0402; Height: 0.016" (0.40mm); Package / Case: 0402 (1005 Metric); Operating Temperature: -55°C ~ 155°C; Size / Dimension: 0.039" L x 0.020" W (1.00mm x 0.50mm); Composition: Thick Film; Packaging: Tape & Reel (TR); Number of Terminations: 2; RoHS: RoHS Compliant
R6 R7 = Res_0402: Manufacturer: Stackpole Electronics Inc; Manufacturer Part Number 1: RMCF0402FT2K20; Part Description: 2.2 kOhms ±1% 0.063W, 1/16W Chip Resistor 0402 (1005 Metric) Automotive AEC-Q200 Thick Film; Resistance (Ohms): 2.2k; Temperature Coefficient: ±100ppm/°C; Power (Watts): 0.063W, 1/16W; Value: 2k2, 1%; Supplier 1: Digi-Key; Supplier Part Number 1: RMCF0402FT2K20CT-ND; Supplier Device Package: 0402; Package / Case: 0402 (1005 Metric); Size / Dimension: 0.039" L x 0.020" W (1.00mm x 0.50mm); Operating Temperature: -55°C ~ 155°C; Composition: Thick Film; Category: Resistors; Features: -; Height: 0.016" (0.40mm); RoHS: RoHS Compliant; Number of Terminations: 2; Packaging: Cut Tape (CT); Tolerance: ±1%

## Sheet 05_FMC_HPC1.SchDoc: FMC_HPC1
size A3; Organization: Lime Microsystems; Address1: Surrey Tech Centre; Address2: Guildford GU2 7YG; Address3: Surrey; Address4: United Kingdom; Revision: v1.0; SheetNumber: 5; SheetTotal: 11
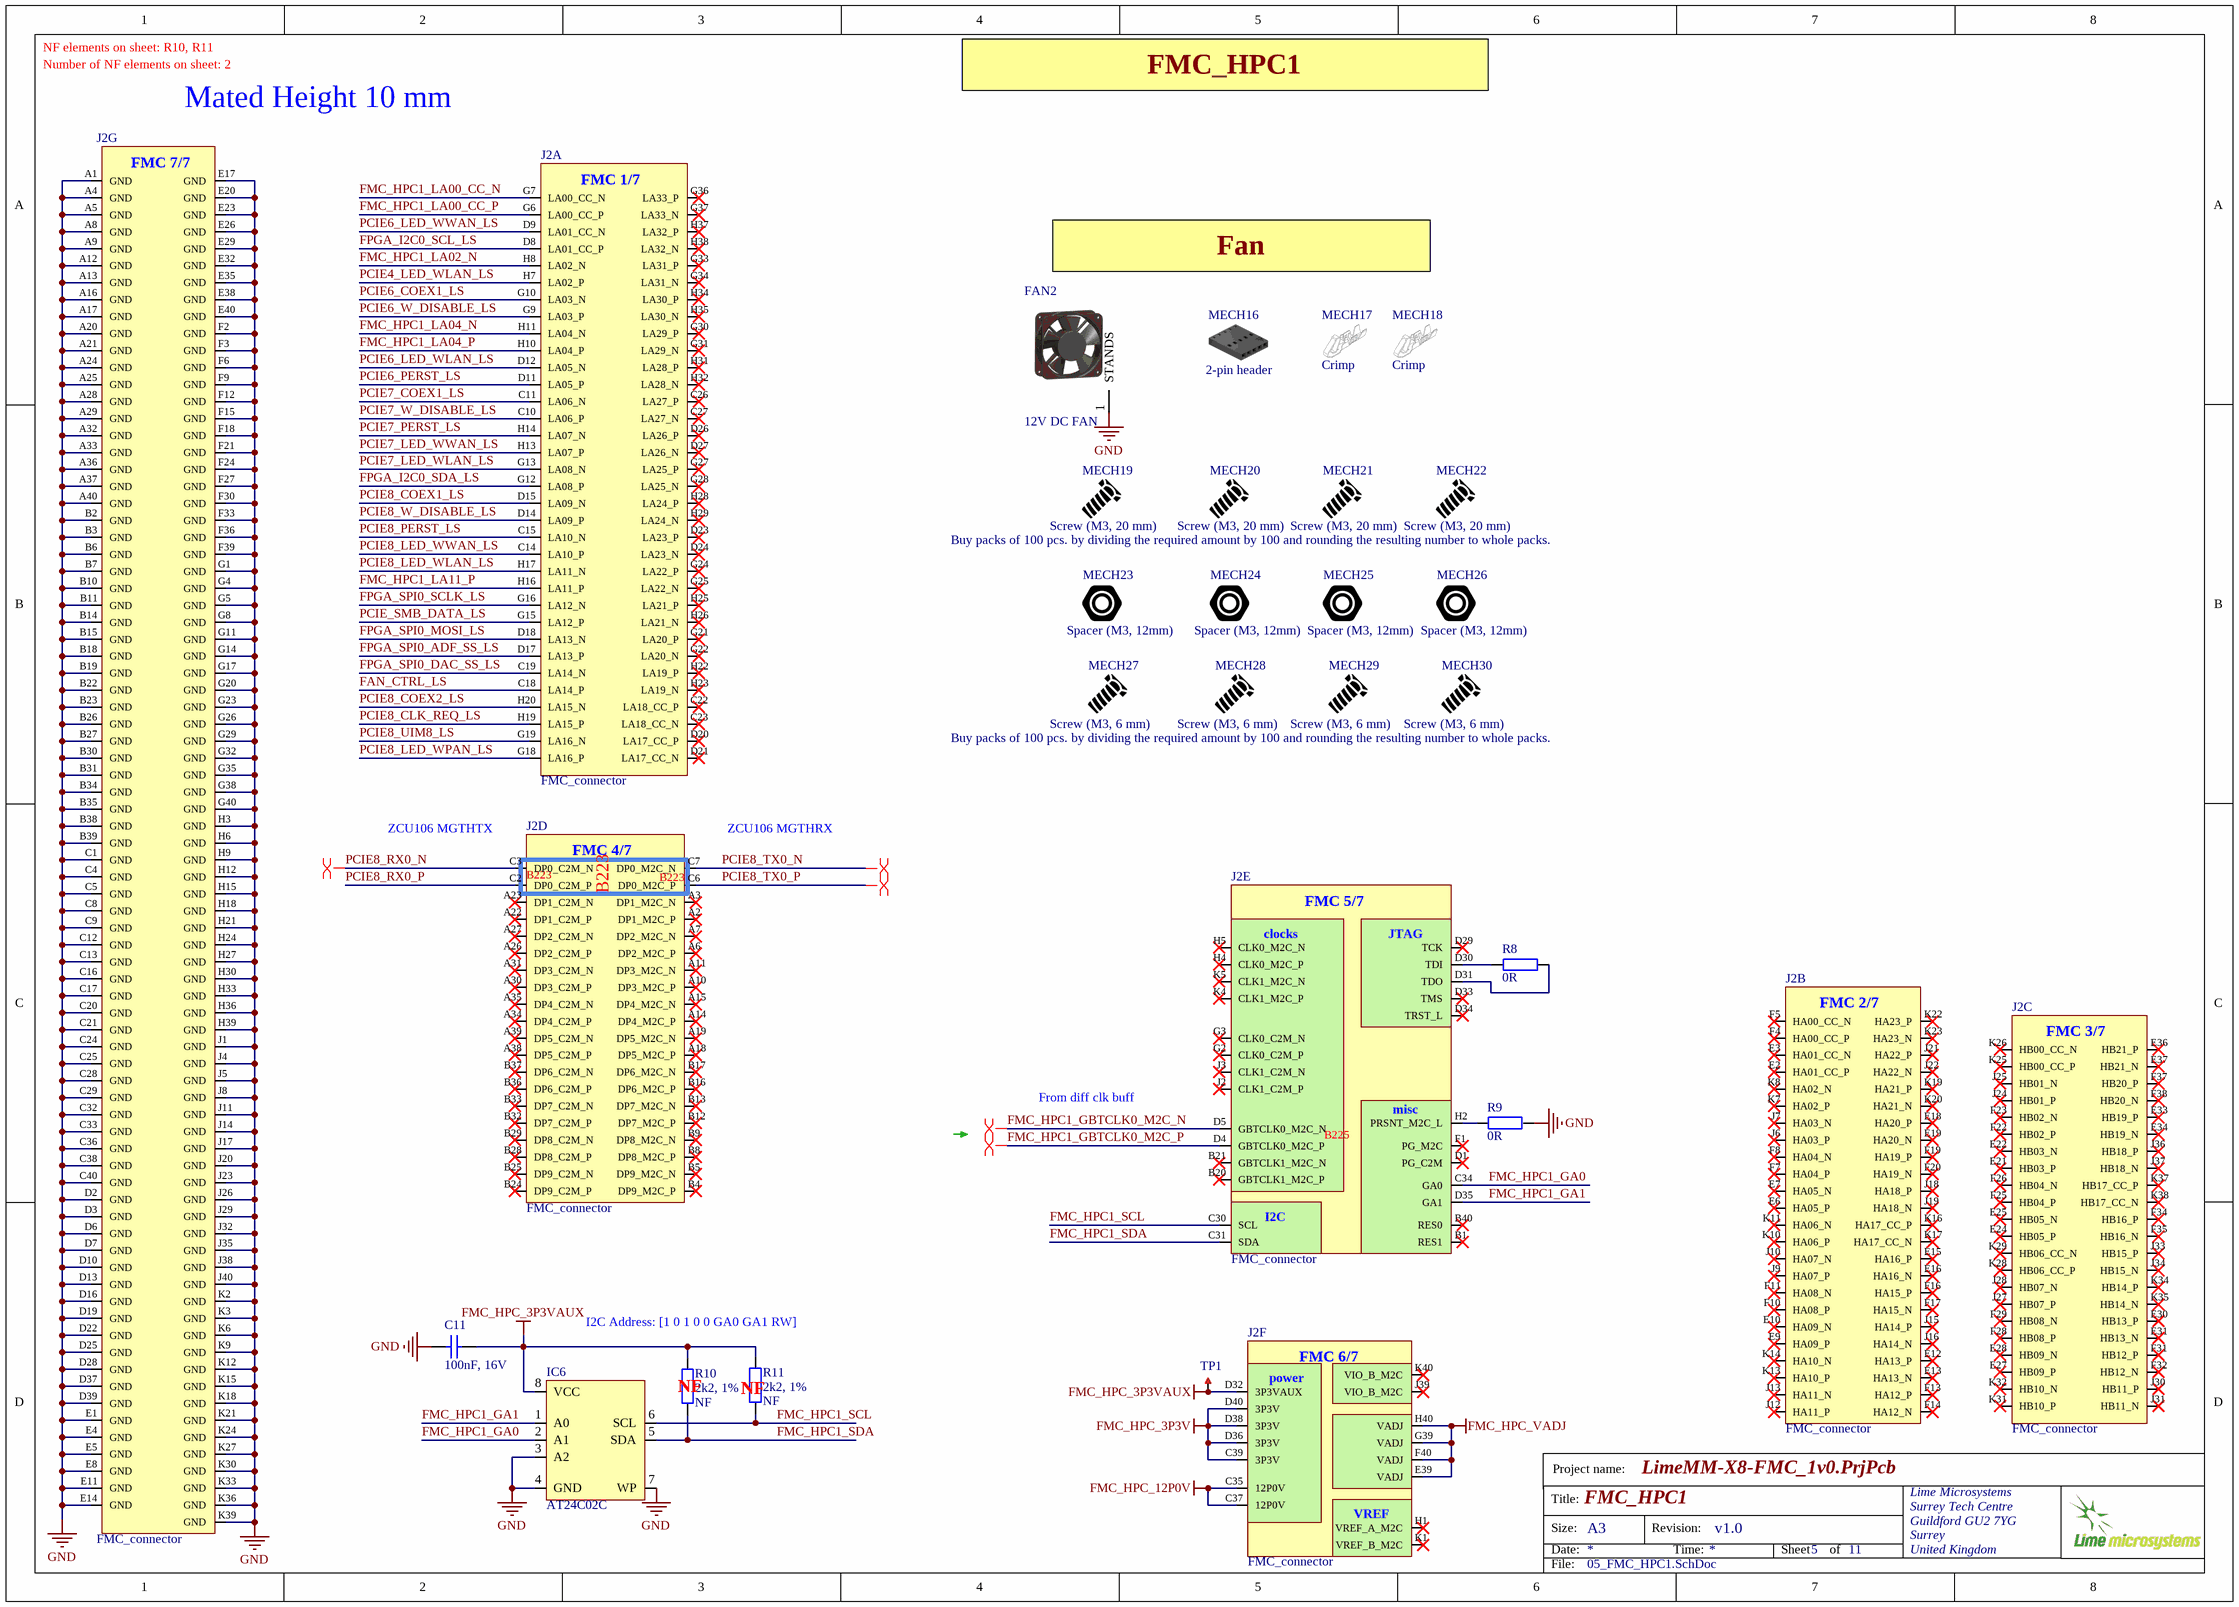
[diagram p4: 05_FMC_HPC1.SchDoc]

### Parts
C11  100nF, 16V  [CAP0402]
FAN2  12V DC FAN  [FAN_80mm]
IC6  AT24C02C  [SOIC127P600-8DL_v2]
J2  FMC_connector  [FMC_HPC_terminal_conn_ASP-134488-01]  (parts A,B,C,D,E,F,G of 7)
MECH16  2-pin header  (mechanical)
MECH17  Crimp  (mechanical)
MECH18  Crimp  (mechanical)
MECH19  Screw (M3, 20 mm)  (mechanical)
MECH20  Screw (M3, 20 mm)  Assembly Info: Buy packs of 100 pcs. by dividing the required amount by 100 and rounding the resulting number to whole packs.  (mechanical)
MECH21  Screw (M3, 20 mm)  (mechanical)
MECH22  Screw (M3, 20 mm)  (mechanical)
MECH23  Spacer (M3, 12mm)  (mechanical)
MECH24  Spacer (M3, 12mm)  (mechanical)
MECH25  Spacer (M3, 12mm)  (mechanical)
MECH26  Spacer (M3, 12mm)  (mechanical)
MECH27  Screw (M3, 6 mm)  (mechanical)
MECH28  Screw (M3, 6 mm)  Assembly Info: Buy packs of 100 pcs. by dividing the required amount by 100 and rounding the resulting number to whole packs.  (mechanical)
MECH29  Screw (M3, 6 mm)  (mechanical)
MECH30  Screw (M3, 6 mm)  (mechanical)
R8  0R  [RES0402]
R9  0R  [RES0402]
R10  2k2, 1%  Assembly Info: NF  [RES0402]
R11  2k2, 1%  Assembly Info: NF  [RES0402]
TP1  TESTPOINT_PAD  [TP_PAD_1p5MM]  (value not drawn)  (no BOM)

### Nets
FMC_HPC_3P3V: J2.C39(3P3V) J2.D36(3P3V) J2.D38(3P3V) J2.D40(3P3V)
FMC_HPC_3P3VAUX: C11.1 IC6.8(VCC) J2.D32(3P3VAUX) R10.1 R11.1 TP1.1
FMC_HPC_12P0V: J2.C35(12P0V) J2.C37(12P0V)
FMC_HPC_VADJ: J2.E39(VADJ) J2.F40(VADJ) J2.G39(VADJ) J2.H40(VADJ)
GND: C11.2 FAN2.1(STANDS) IC6.3(A2) IC6.4(GND) IC6.7(WP) J2.A1(GND) J2.A4(GND) J2.A5(GND) J2.A8(GND) J2.A9(GND) J2.A12(GND) J2.A13(GND) J2.A16(GND) J2.A17(GND) J2.A20(GND) J2.A21(GND) J2.A24(GND) J2.A25(GND) J2.A28(GND) J2.A29(GND) J2.A32(GND) J2.A33(GND) J2.A36(GND) J2.A37(GND) J2.A40(GND) J2.B2(GND) J2.B3(GND) J2.B6(GND) J2.B7(GND) J2.B10(GND) J2.B11(GND) J2.B14(GND) J2.B15(GND) J2.B18(GND) J2.B19(GND) J2.B22(GND) J2.B23(GND) J2.B26(GND) J2.B27(GND) J2.B30(GND) J2.B31(GND) J2.B34(GND) J2.B35(GND) J2.B38(GND) J2.B39(GND) J2.C1(GND) J2.C4(GND) J2.C5(GND) J2.C8(GND) J2.C9(GND) J2.C12(GND) J2.C13(GND) J2.C16(GND) J2.C17(GND) J2.C20(GND) J2.C21(GND) J2.C24(GND) J2.C25(GND) J2.C28(GND) J2.C29(GND) J2.C32(GND) J2.C33(GND) J2.C36(GND) J2.C38(GND) J2.C40(GND) J2.D2(GND) J2.D3(GND) J2.D6(GND) J2.D7(GND) J2.D10(GND) J2.D13(GND) J2.D16(GND) J2.D19(GND) J2.D22(GND) J2.D25(GND) J2.D28(GND) J2.D37(GND) J2.D39(GND) J2.E1(GND) J2.E4(GND) J2.E5(GND) J2.E8(GND) J2.E11(GND) J2.E14(GND) J2.E17(GND) J2.E20(GND) J2.E23(GND) J2.E26(GND) J2.E29(GND) J2.E32(GND) J2.E35(GND) J2.E38(GND) J2.E40(GND) J2.F2(GND) J2.F3(GND) J2.F6(GND) J2.F9(GND) J2.F12(GND) J2.F15(GND) J2.F18(GND) J2.F21(GND) J2.F24(GND) J2.F27(GND) J2.F30(GND) J2.F33(GND) J2.F36(GND) J2.F39(GND) J2.G1(GND) J2.G4(GND) J2.G5(GND) J2.G8(GND) J2.G11(GND) J2.G14(GND) J2.G17(GND) J2.G20(GND) J2.G23(GND) J2.G26(GND) J2.G29(GND) J2.G32(GND) J2.G35(GND) J2.G38(GND) J2.G40(GND) J2.H3(GND) J2.H6(GND) J2.H9(GND) J2.H12(GND) J2.H15(GND) J2.H18(GND) J2.H21(GND) J2.H24(GND) J2.H27(GND) J2.H30(GND) J2.H33(GND) J2.H36(GND) J2.H39(GND) J2.J1(GND) J2.J4(GND) J2.J5(GND) J2.J8(GND) J2.J11(GND) J2.J14(GND) J2.J17(GND) J2.J20(GND) J2.J23(GND) J2.J26(GND) J2.J29(GND) J2.J32(GND) J2.J35(GND) J2.J38(GND) J2.J40(GND) J2.K2(GND) J2.K3(GND) J2.K6(GND) J2.K9(GND) J2.K12(GND) J2.K15(GND) J2.K18(GND) J2.K21(GND) J2.K24(GND) J2.K27(GND) J2.K30(GND) J2.K33(GND) J2.K36(GND) J2.K39(GND) R9.2
FAN_CTRL_LS: J2.C18(LA14_P)
FMC_HPC1_GA0: IC6.2(A1) J2.C34(GA0)
FMC_HPC1_GA1: IC6.1(A0) J2.D35(GA1)
FMC_HPC1_GBTCLK0_M2C_N: J2.D5(GBTCLK0_M2C_N)
FMC_HPC1_GBTCLK0_M2C_P: J2.D4(GBTCLK0_M2C_P)
FMC_HPC1_LA00_CC_N: J2.G7(LA00_CC_N)
FMC_HPC1_LA00_CC_P: J2.G6(LA00_CC_P)
FMC_HPC1_LA02_N: J2.H8(LA02_N)
FMC_HPC1_LA04_N: J2.H11(LA04_N)
FMC_HPC1_LA04_P: J2.H10(LA04_P)
FMC_HPC1_LA11_P: J2.H16(LA11_P)
FMC_HPC1_SCL: IC6.6(SCL) J2.C30(SCL) R11.2
FMC_HPC1_SDA: IC6.5(SDA) J2.C31(SDA) R10.2
FPGA_I2C0_SCL_LS: J2.D8(LA01_CC_P)
FPGA_I2C0_SDA_LS: J2.G12(LA08_P)
FPGA_SPI0_ADF_SS_LS: J2.D17(LA13_P)
FPGA_SPI0_DAC_SS_LS: J2.C19(LA14_N)
FPGA_SPI0_MOSI_LS: J2.D18(LA13_N)
FPGA_SPI0_SCLK_LS: J2.G16(LA12_N)
PCIE4_LED_WLAN_LS: J2.H7(LA02_P)
PCIE6_COEX1_LS: J2.G10(LA03_N)
PCIE6_LED_WLAN_LS: J2.D12(LA05_N)
PCIE6_LED_WWAN_LS: J2.D9(LA01_CC_N)
PCIE6_PERST_LS: J2.D11(LA05_P)
PCIE6_W_DISABLE_LS: J2.G9(LA03_P)
PCIE7_COEX1_LS: J2.C11(LA06_N)
PCIE7_LED_WLAN_LS: J2.G13(LA08_N)
PCIE7_LED_WWAN_LS: J2.H13(LA07_P)
PCIE7_PERST_LS: J2.H14(LA07_N)
PCIE7_W_DISABLE_LS: J2.C10(LA06_P)
PCIE8_CLK_REQ_LS: J2.H19(LA15_P)
PCIE8_COEX1_LS: J2.D15(LA09_N)
PCIE8_COEX2_LS: J2.H20(LA15_N)
PCIE8_LED_WLAN_LS: J2.H17(LA11_N)
PCIE8_LED_WPAN_LS: J2.G18(LA16_P)
PCIE8_LED_WWAN_LS: J2.C14(LA10_P)
PCIE8_PERST_LS: J2.C15(LA10_N)
PCIE8_RX0_N: J2.C3(DP0_C2M_N)
PCIE8_RX0_P: J2.C2(DP0_C2M_P)
PCIE8_TX0_N: J2.C7(DP0_M2C_N)
PCIE8_TX0_P: J2.C6(DP0_M2C_P)
PCIE8_UIM8_LS: J2.G19(LA16_N)
PCIE8_W_DISABLE_LS: J2.D14(LA09_P)
PCIE_SMB_DATA_LS: J2.G15(LA12_P)
NetJ2_D30: J2.D30(TDI) R8.2
NetJ2_D31: J2.D31(TDO) R8.1
NetJ2_H2: J2.H2(PRSNT_M2C_L) R9.1

Not connected (* = marked no-connect by the designer): J2 A2(DP1_M2C_P)* A3(DP1_M2C_N)* A6(DP2_M2C_P)* A7(DP2_M2C_N)* A10(DP3_M2C_P)* A11(DP3_M2C_N)* A14(DP4_M2C_P)* A15(DP4_M2C_N)* A18(DP5_M2C_P)* A19(DP5_M2C_N)* A22(DP1_C2M_P)* A23(DP1_C2M_N)* A26(DP2_C2M_P)* A27(DP2_C2M_N)* A30(DP3_C2M_P)* A31(DP3_C2M_N)* A34(DP4_C2M_P)* A35(DP4_C2M_N)* A38(DP5_C2M_P)* A39(DP5_C2M_N)* B1(RES1)* B4(DP9_M2C_P)* B5(DP9_M2C_N)* B8(DP8_M2C_P)* B9(DP8_M2C_N)* B12(DP7_M2C_P)* B13(DP7_M2C_N)* B16(DP6_M2C_P)* B17(DP6_M2C_N)* B20(GBTCLK1_M2C_P)* B21(GBTCLK1_M2C_N)* B24(DP9_C2M_P)* B25(DP9_C2M_N)* B28(DP8_C2M_P)* B29(DP8_C2M_N)* B32(DP7_C2M_P)* B33(DP7_C2M_N)* B36(DP6_C2M_P)* B37(DP6_C2M_N)* B40(RES0)* C22(LA18_CC_P)* C23(LA18_CC_N)* C26(LA27_P)* C27(LA27_N)* D1(PG_C2M)* D20(LA17_CC_P)* D21(LA17_CC_N)* D23(LA23_P)* D24(LA23_N)* D26(LA26_P)* D27(LA26_N)* D29(TCK)* D33(TMS)* D34(TRST_L)* E2(HA01_CC_P)* E3(HA01_CC_N)* E6(HA05_P)* E7(HA05_N)* E9(HA09_P)* E10(HA09_N)* E12(HA13_P)* E13(HA13_N)* E15(HA16_P)* E16(HA16_N)* E18(HA20_P)* E19(HA20_N)* E21(HB03_P)* E22(HB03_N)* E24(HB05_P)* E25(HB05_N)* E27(HB09_P)* E28(HB09_N)* E30(HB13_P)* E31(HB13_N)* E33(HB19_P)* E34(HB19_N)* E36(HB21_P)* E37(HB21_N)* F1(PG_M2C)* F4(HA00_CC_P)* F5(HA00_CC_N)* F7(HA04_P)* F8(HA04_N)* F10(HA08_P)* F11(HA08_N)* F13(HA12_P)* F14(HA12_N)* F16(HA15_P)* F17(HA15_N)* F19(HA19_P)* F20(HA19_N)* F22(HB02_P)* F23(HB02_N)* F25(HB04_P)* F26(HB04_N)* F28(HB08_P)* F29(HB08_N)* F31(HB12_P)* F32(HB12_N)* F34(HB16_P)* F35(HB16_N)* F37(HB20_P)* F38(HB20_N)* G2(CLK0_C2M_P)* G3(CLK0_C2M_N)* G21(LA20_P)* G22(LA20_N)* G24(LA22_P)* G25(LA22_N)* G27(LA25_P)* G28(LA25_N)* G30(LA29_P)* G31(LA29_N)* G33(LA31_P)* G34(LA31_N)* G36(LA33_P)* G37(LA33_N)* H1(VREF_A_M2C)* H4(CLK0_M2C_P)* H5(CLK0_M2C_N)* H22(LA19_P)* H23(LA19_N)* H25(LA21_P)* H26(LA21_N)* H28(LA24_P)* H29(LA24_N)* H31(LA28_P)* H32(LA28_N)* H34(LA30_P)* H35(LA30_N)* H37(LA32_P)* H38(LA32_N)* J2(CLK1_C2M_P)* J3(CLK1_C2M_N)* J6(HA03_P)* J7(HA03_N)* J9(HA07_P)* J10(HA07_N)* J12(HA11_P)* J13(HA11_N)* J15(HA14_P)* J16(HA14_N)* J18(HA18_P)* J19(HA18_N)* J21(HA22_P)* J22(HA22_N)* J24(HB01_P)* J25(HB01_N)* J27(HB07_P)* J28(HB07_N)* J30(HB11_P)* J31(HB11_N)* J33(HB15_P)* J34(HB15_N)* J36(HB18_P)* J37(HB18_N)* J39(VIO_B_M2C)* K1(VREF_B_M2C)* K4(CLK1_M2C_P)* K5(CLK1_M2C_N)* K7(HA02_P)* K8(HA02_N)* K10(HA06_P)* K11(HA06_N)* K13(HA10_P)* K14(HA10_N)* K16(HA17_CC_P)* K17(HA17_CC_N)* K19(HA21_P)* K20(HA21_N)* K22(HA23_P)* K23(HA23_N)* K25(HB00_CC_P)* K26(HB00_CC_N)* K28(HB06_CC_P)* K29(HB06_CC_N)* K31(HB10_P)* K32(HB10_N)* K34(HB14_P)* K35(HB14_N)* K37(HB17_CC_P)* K38(HB17_CC_N)* K40(VIO_B_M2C)*

### Layout directives
differential pair: FMC_HPC1_GBTCLK0_M2C_N, FMC_HPC1_GBTCLK0_M2C_P, PCIE8_RX0_N, PCIE8_TX0_N, PCIE8_TX0_P

### Notes on the sheet
- NF elements on sheet: R10, R11
- Number of NF elements on sheet: 2
- Mated Height 10 mm
- FMC_HPC1
- Fan
- ZCU106 MGTHTX
- (near J2) ZCU106 MGTHRX
- (near J2) B223
- From diff clk buff
- (near J2) B225
- I2C Address: [1 0 1 0 0 GA0 GA1 RW]
- (near R10) NF
- (near R11) NF
- Project name:
- Title:
- Size:
- Date:
- A3
- Revision:
- Time:
- Sheet
- of
- File:
- (in symbol FMC_connector, part A) FMC 1/7
- (in symbol FMC_connector, part B) FMC 2/7
- (in symbol FMC_connector, part C) FMC 3/7
- (in symbol FMC_connector, part D) FMC 4/7
- (in symbol FMC_connector, part E) FMC 5/7; clocks /; JTAG /; misc /; I2C /
- (in symbol FMC_connector, part F) FMC 6/7; power /; VREF /
- (in symbol FMC_connector, part G) FMC 7/7

### Library data of the parts
C11 = Cap_0603: as C2 on sheet 04_FMC_HPC0; Supplier 1: Mouser; Supplier Part Number 1: 81-GRM155R71C104KA88; Case Code - in: 0402; Manufacturer: Murata Electronics; Category: Multilayer Ceramic Capacitors MLCC - SMD/SMT; Voltage Rating DC: 16 V; Value: 100nF, 16V; Case Code - mm: 1005; Case Width: 0.5 mm; Maximum Operating Temperature: + 125 C; Minimum Operating Temperature: - 55 C; Minimum Order Quantity: 1; Operating Temperature Range: - 55 C to + 125 C; Package / Case: 0402 (1005 metric); Packaging: Reel; Product: General Type MLCCs; Product Category: Low & Medium Capacitance SMD Ceramic Chip Capacitors; Reeling: True; RoHS - Mouser: Y; RoHS: RoHS Compliant; Series: GRM; Standard Pack Qty: 10000; Termination Style: SMD/SMT
FAN2 = 12V_DC_FAN: as FAN1 on sheet 04_FMC_HPC0; Supplier 1: Digi-Key; Supplier Part Number 1: 259-1649-ND; Stock 1: 1611; Pricing 1: 1=6,90000, 10=6,66700, 25=6,47400, 50=6,08860, 100=5,47200, 250=5,39488, 500=5,04808 (USD); RoHS: Yes; Case/Package: Axial; Housing Material: Thermoplastic; Weight: 0.15lb; Min Operating Temperature: 14°C; Max Operating Temperature: 158°C; Termination: 2 Wire Leads; Package Quantity: 30; Width: 15mm; Flammability Rating: UL94 V-0; ComponentLink1URL: https://datasheet.ciiva.com/18514/me8015-u-18514537.pdf?src-supplier=Digi-Key; ComponentLink1Description: https://datasheet.ciiva.com/18514/me8015-u-18514537.pdf?src-supplier=Digi-Key
IC6 = AT24C02C-SSHM-B: as IC5 on sheet 04_FMC_HPC0; Supplier 1: Farnell; Supplier Part Number 1: 2345577
J2 = FMC_connector: Manufacturer: Samtec; Manufacturer Part Number 1: ASP-134488-01; Part Description: 400 Position Connector Array, Male Pins Surface Mount Gold; Gender: Male; Number of Contacts: 400; Pitch: 1.27mm; ComponentLink1Description: https://datasheet.ciiva.com/403/asp-134488-01-403749.pdf?src-supplier=Digi-Key; ComponentLink1URL: https://datasheet.ciiva.com/403/asp-134488-01-403749.pdf?src-supplier=Digi-Key; ComponentLink2Description: https://datasheet.ciiva.com/9532/asp-134488-01-9532666.pdf?src-supplier=Avnet; ComponentLink2URL: https://datasheet.ciiva.com/9532/asp-134488-01-9532666.pdf?src-supplier=Avnet; Contact Material: Copper Alloy; Contact Plating: Gold; Mount: Surface Mount; Number of Positions: 400; Number of Rows: 10; Packaging: Strip; Pricing 1: 1=31,75, 10=27,799, 25=26,598, 50=25,7398, 100=24,8819, 250=23,50908 (USD); Radiation Hardening: No; Reach SVHC Compliant: No; RoHS: Yes; RoHS Compliant: Yes; Series: ASP; Stock 1: 1651; Supplier 1: Digi-Key; Supplier Part Number 1: SAM8730-ND; Termination: SMD/SMT
MECH16 = Universal_crimped_header: as MECH1 on sheet 04_FMC_HPC0; Supplier 1: Newark; Supplier Part Number 1: 47T5763; Manufacturer Part Number 1: 22-01-2027; Stock 1: 50789; Pricing 1: 1=0,12200, 10=0,09500, 25=0,08600, 50=0,07700, 100=0,06700, 250=0,06400 (USD); RoHS: Yes; Mount: Free Hanging,Cable; Contact Material: Bronze,Brass; Color: White; Housing Color: White; Housing Material: Nylon; Min Operating Temperature: 0°C; Max Operating Temperature: 75°C; Number of Rows: 1; Package Quantity: 5000; Packaging: Bag; Termination: Crimp; Number of Circuits: 2; Number of Positions: 2; Orientation: Straight; Series: KK® 2695; Contact Type: Non-Gendered; Contact Gender: Female; Fastening Type: Ramp; Length: 5.64mm; Width: 4.82mm; Height: 4.82mm; Depth: 12.7mm; Lead Pitch: 2.54mm; Radiation Hardening: No; Halogen Free: Low Halogen; Flammability Rating: UL94 V-0; RoHS Compliant: Yes; Lead Free: Lead Free
MECH17 MECH18 = Universal_crimp: as MECH2 on sheet 04_FMC_HPC0; Supplier 1: Mouser; Supplier Part Number 1: 538-08-50-0032; Manufacturer Part Number 1: 08-50-0032; Stock 1: 153072; Pricing 1: 1=0,12000, 10=0,08100, 50=0,08000, 100=0,08000, 1000=0,06400, 10000=0,06400 (USD); RoHS: Yes; Mount: Cable; Contact Material: Brass; Housing Material: Nylon; Terminal Material: Brass; Contact Plating: Tin,Brass; Min Operating Temperature: 0°C; Max Operating Temperature: 75°C; Contact Gender: Female; Packaging: Bulk; Termination: Crimp; Orientation: Straight; Series: KK® 4809; Contact Type: Signal; Voltage Rating (AC): 250V; Package Quantity: 80000; Max Voltage Rating (AC): 250V; Length: 10.4mm; Depth: 2.1mm; Wire/Cable Gauge: 30AWG; Radiation Hardening: No; RoHS Compliant: Yes; Reach SVHC Compliant: Yes; ComponentLink1URL: https://datasheet.ciiva.com/15217/getdatasheetpartid-168593-15217171.pdf?src-supplier=Verical; ComponentLink1Description: https://datasheet.ciiva.com/15217/getdatasheetpartid-168593-15217171.pdf?src-supplier=Verical; ComponentLink2URL: https://datasheet.ciiva.com/19462/736464-19462410.pdf?src-supplier=Jameco; ComponentLink2Description: https://datasheet.ciiva.com/19462/736464-19462410.pdf?src-supplier=Jameco; ComponentLink3URL: https://datasheet.ciiva.com/11723/0900766b80027326-11723308.pdf?src-supplier=Rs; ComponentLink3Description: https://datasheet.ciiva.com/11723/0900766b80027326-11723308.pdf?src-supplier=Rs
MECH19 MECH21 MECH22 = Universal_mech_screw: as MECH4 on sheet 04_FMC_HPC0; Supplier 1: Farnell; Supplier Part Number 1: 1420401; Stock 1: 226; Pricing 1: 1=2,66000, 30=1,88000, 60=1,77000 (EUR); RoHS: No; ComponentLink1URL: http://www.farnell.com/datasheets/2644719.pdf?src-supplier=Farnell; ComponentLink1Description: http://www.farnell.com/datasheets/2644719.pdf?src-supplier=Farnell
MECH20 = Universal_mech_screw: as MECH5 on sheet 04_FMC_HPC0; Supplier 1: Farnell; Supplier Part Number 1: 1420401; Stock 1: 226; Pricing 1: 1=2,66000, 30=1,88000, 60=1,77000 (EUR); RoHS: No; ComponentLink1URL: http://www.farnell.com/datasheets/2644719.pdf?src-supplier=Farnell; ComponentLink1Description: http://www.farnell.com/datasheets/2644719.pdf?src-supplier=Farnell
MECH23-MECH26 = Universal_mech_nut: as MECH8 on sheet 04_FMC_HPC0; Manufacturer Part Number 1: 005.03.123; Supplier 1: Farnell; Supplier Part Number 1: 1466772
MECH27 MECH29 MECH30 = Universal_mech_screw: as MECH12 on sheet 04_FMC_HPC0; Supplier 1: Farnell; Supplier Part Number 1: 1419986; Stock 1: 2173; Pricing 1: 1=1,90000, 25=1,35000, 50=1,23000 (EUR); RoHS: No; ComponentLink1URL: http://www.farnell.com/datasheets/2644718.pdf?src-supplier=Farnell; ComponentLink1Description: http://www.farnell.com/datasheets/2644718.pdf?src-supplier=Farnell
MECH28 = Universal_mech_screw: as MECH13 on sheet 04_FMC_HPC0; Supplier 1: Farnell; Supplier Part Number 1: 1419986; Stock 1: 2173; Pricing 1: 1=1,90000, 25=1,35000, 50=1,23000 (EUR); RoHS: No; ComponentLink1URL: http://www.farnell.com/datasheets/2644718.pdf?src-supplier=Farnell; ComponentLink1Description: http://www.farnell.com/datasheets/2644718.pdf?src-supplier=Farnell
R8 R9 = Res_0402: as R4 on sheet 04_FMC_HPC0; Value: 0R; Supplier 1: Digi-Key; Supplier Part Number 1: 311-0.0JRTR-ND; Category: Resistors; Temperature Coefficient: -; Features: Moisture Resistant; Supplier Device Package: 0402; Height: 0.016" (0.40mm); Package / Case: 0402 (1005 Metric); Operating Temperature: -55°C ~ 155°C; Size / Dimension: 0.039" L x 0.020" W (1.00mm x 0.50mm); Composition: Thick Film; Packaging: Tape & Reel (TR); Number of Terminations: 2; RoHS: RoHS Compliant
R10 R11 = Res_0402: as R6 on sheet 04_FMC_HPC0; Value: 2k2, 1%; Supplier 1: Digi-Key; Supplier Part Number 1: RMCF0402FT2K20CT-ND; Supplier Device Package: 0402; Package / Case: 0402 (1005 Metric); Size / Dimension: 0.039" L x 0.020" W (1.00mm x 0.50mm); Operating Temperature: -55°C ~ 155°C; Composition: Thick Film; Category: Resistors; Features: -; Height: 0.016" (0.40mm); RoHS: RoHS Compliant; Number of Terminations: 2; Packaging: Cut Tape (CT); Tolerance: ±1%
TP1 = TESTPOINT_PAD: Test Point PCB mount Miniature White